# EasyEDA Pro project grandPA2.eprj, board matrix
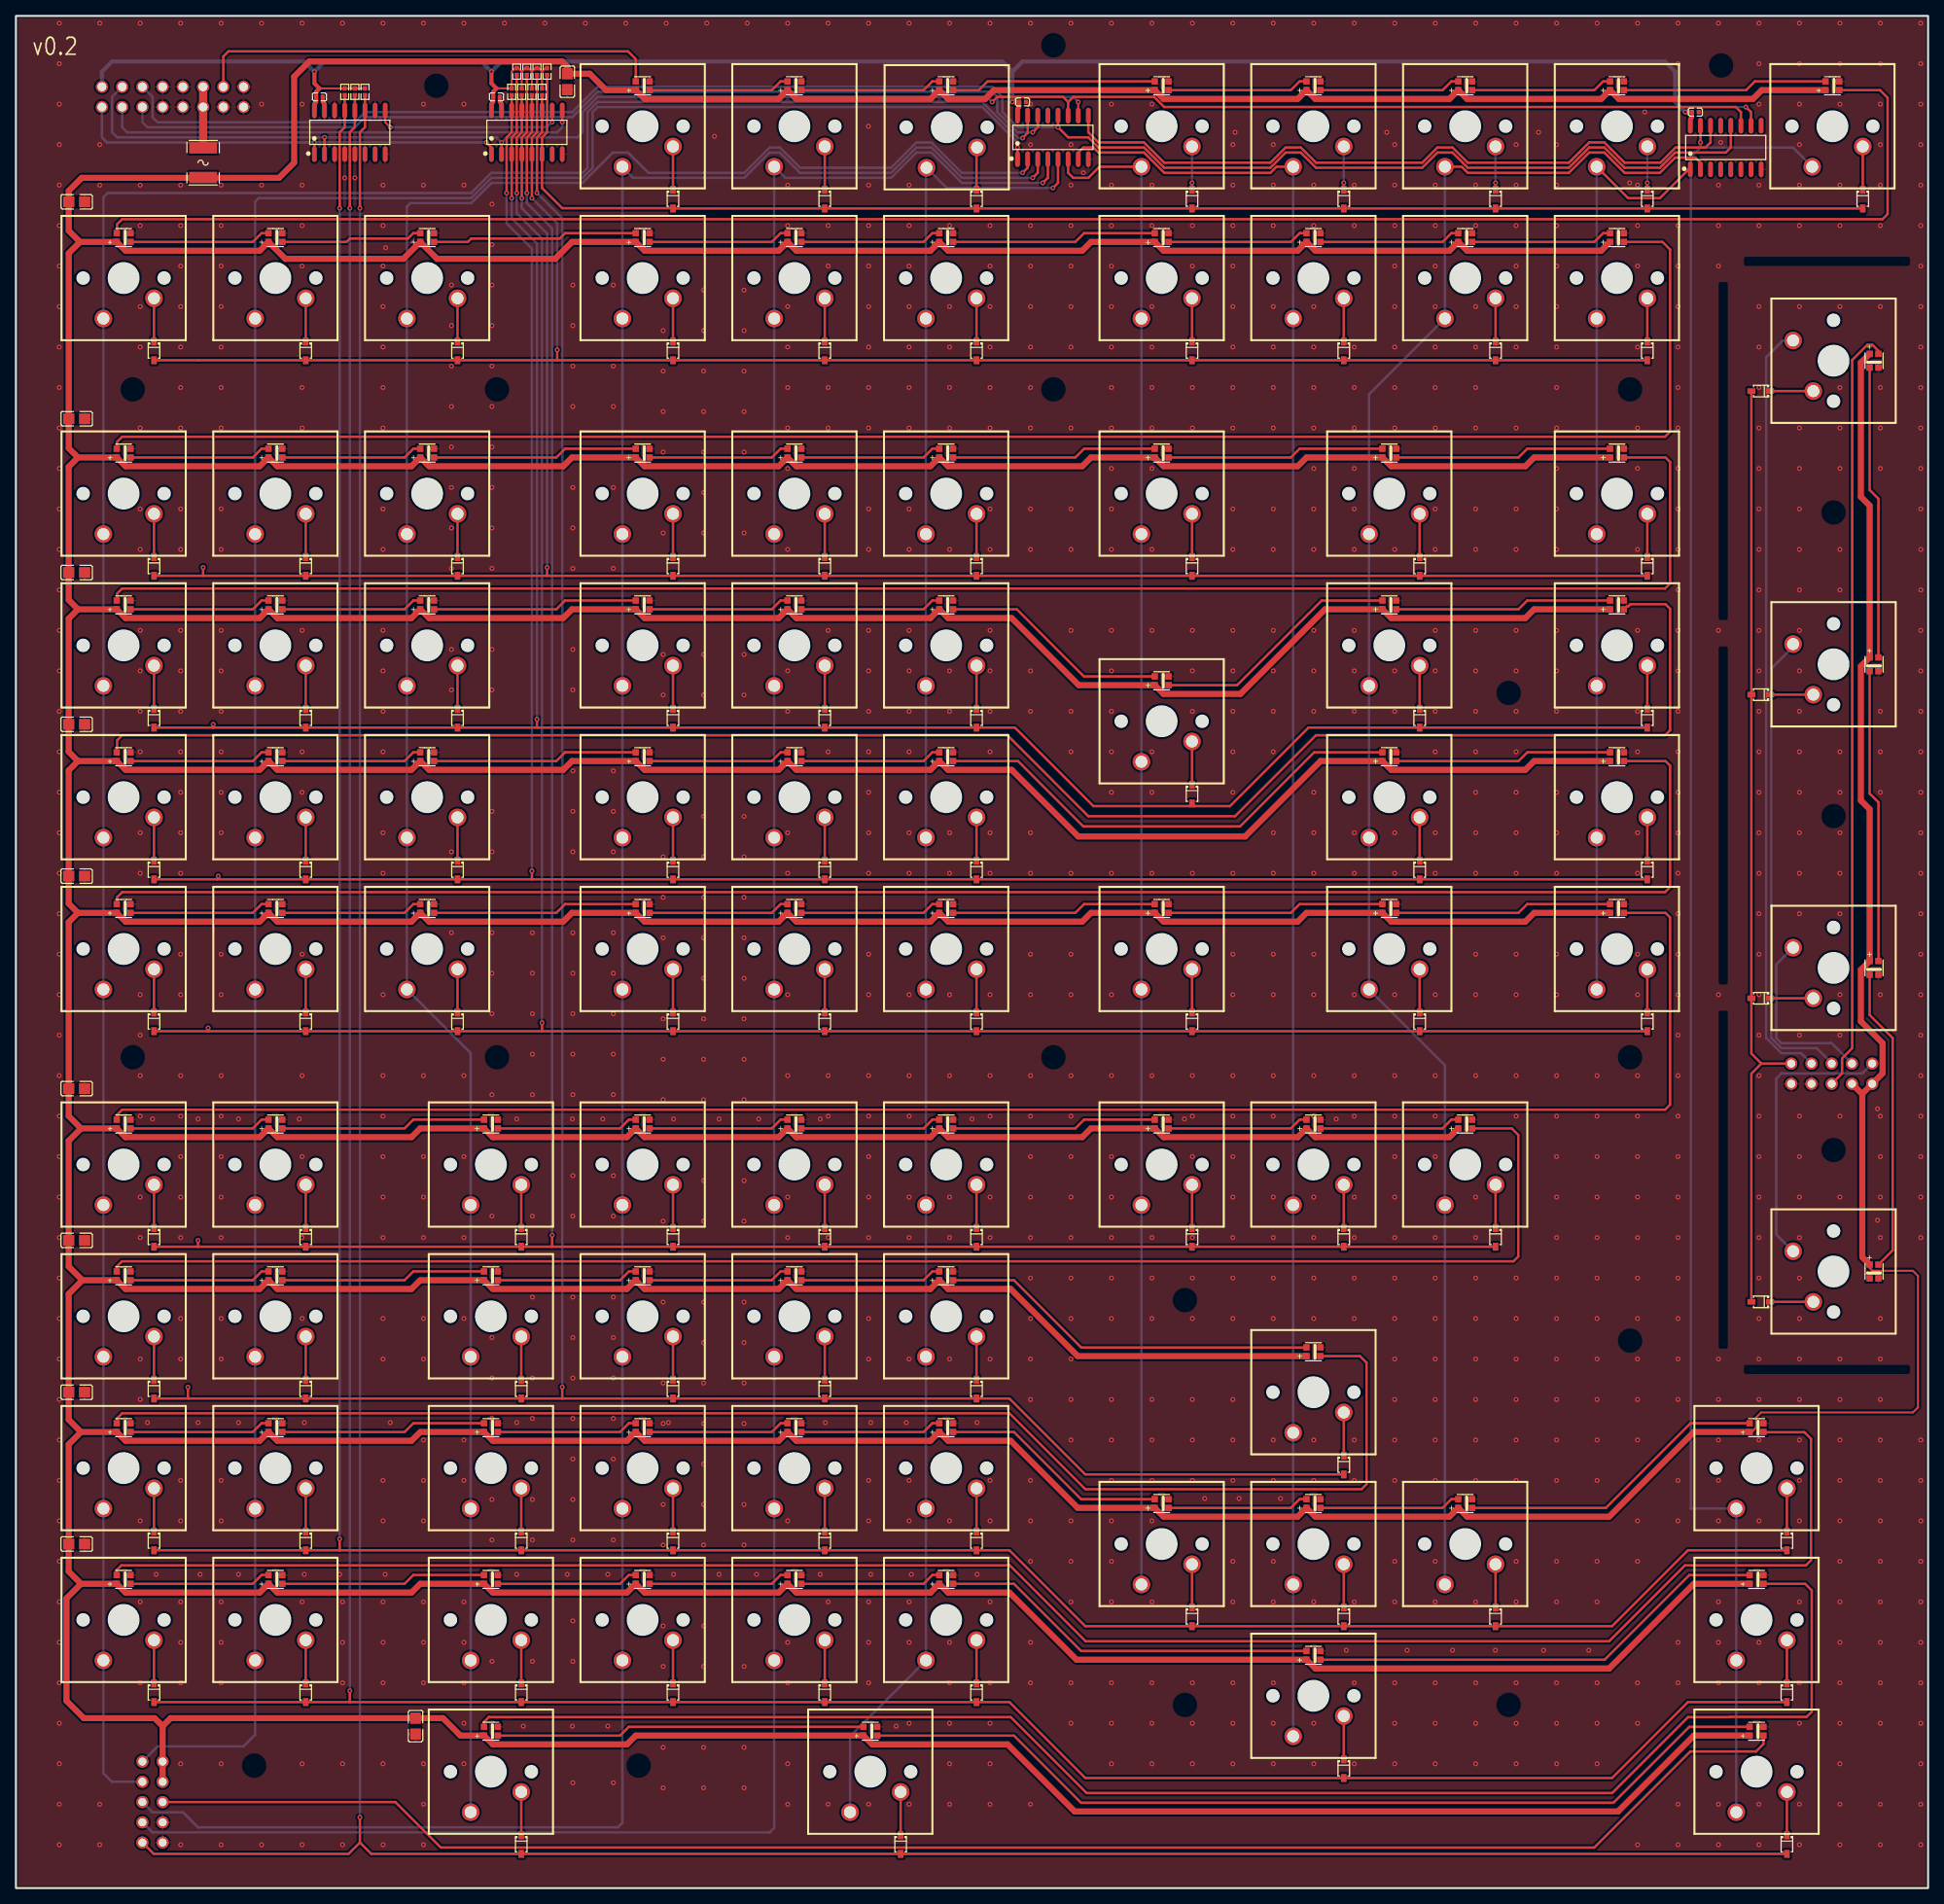
[diagram p4: board, top side]
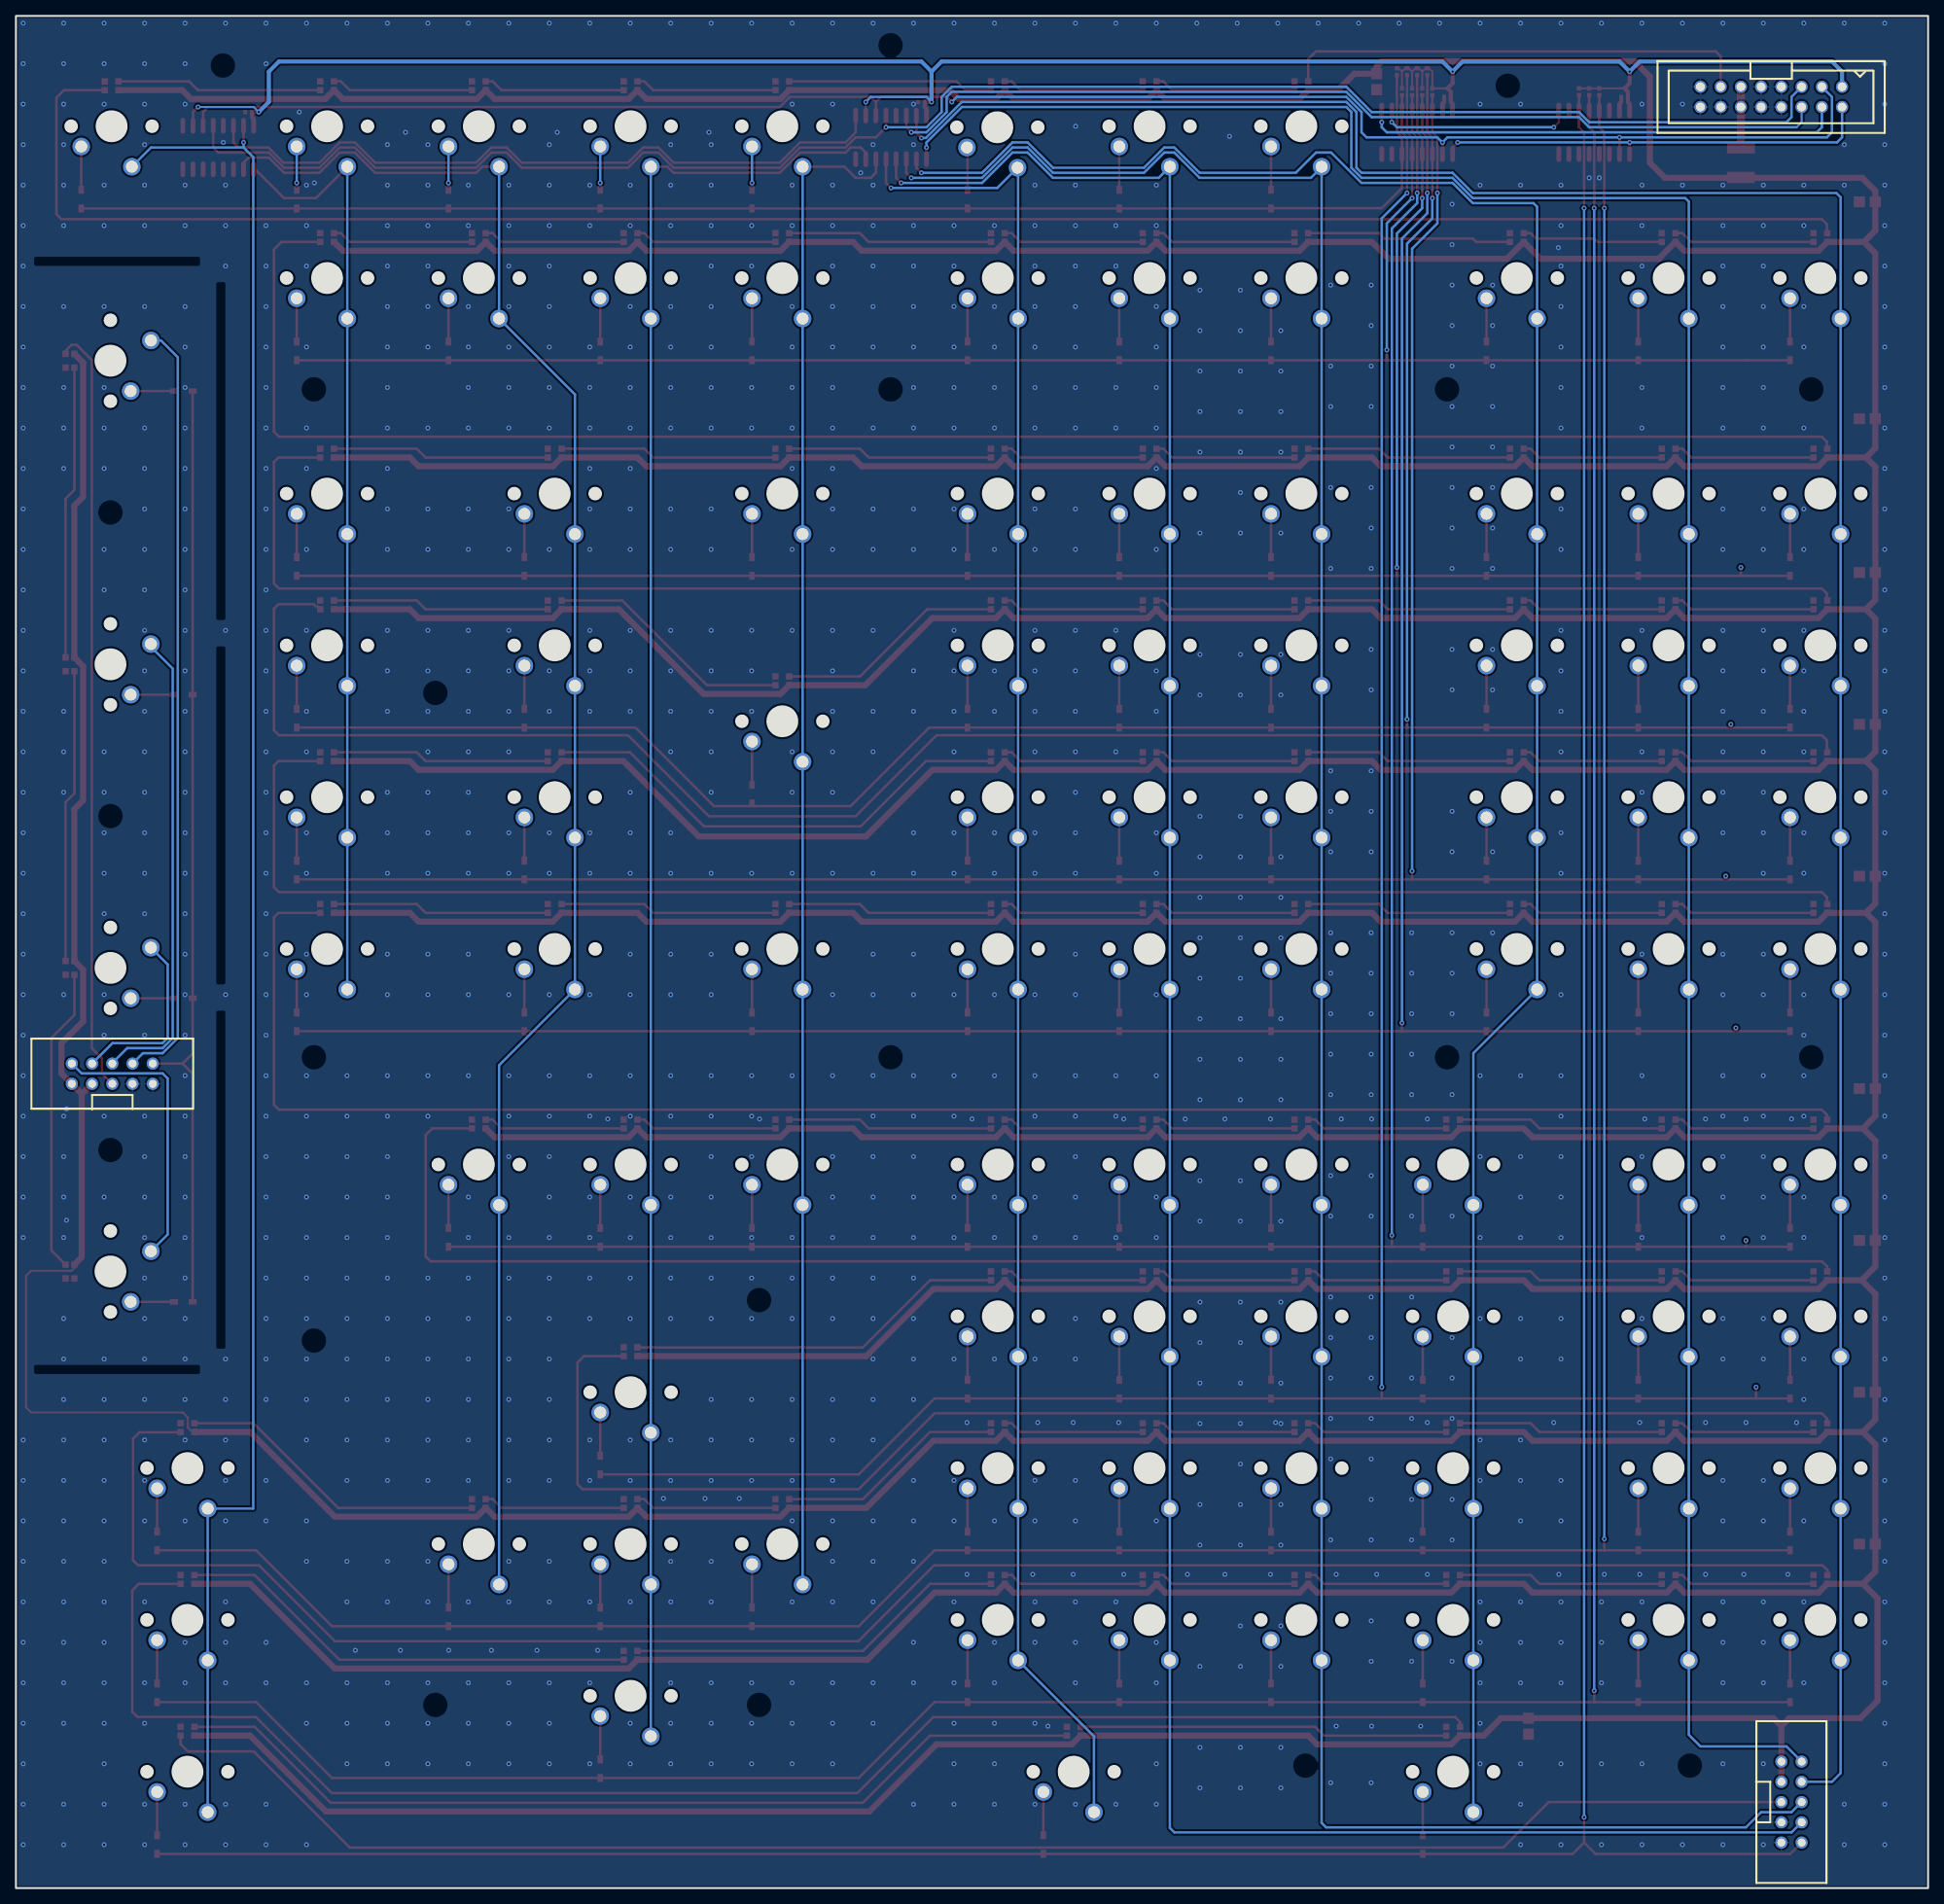
[diagram p5: board, bottom side, seen from below]

Outline 240.03 x 234.95 mm; copper layers: Top Layer, Bottom Layer. Coordinates in mm from the lower left corner of the outline.
Outline path: rectangle 0,234.95 240.03,0
Stack: Top Layer 0.035mm / Dielectric1 1.51mm FR4 er 4.5 / Bottom Layer 0.035mm

## Design rules (mm)
template: JLCPCB Capability(Two Layers Board)
spacing copperThickness1oz (default): track to track 0.102, other pairs 0.152 to 0.3
spacing copperThickness2oz: track to track 0.203, other pairs 0.152 to 0.3
track width copperThickness1oz (default): min 0.127, default 0.254, max 2.54
track width copperThickness2oz: min 0.203, default 0.254, max 2.54
differential pair differentialPair (default): width min 0.127, default 0.254, max 2.54; gap min 0.152, default 0.152
via viaSize (default): diameter min 0.5, default 0.61, max 10; hole min 0.3, default 0.305, max 6.3

## Placement (name value [footprint] x y rotation side)
C1  10uF  [C0805]  7.63 211.62 180 top
C2  10uF  [C0805]  7.63 184.4 180 top
C3  10uF  [C0805]  7.62 165.1 0 top
C4  10uF  [C0805]  7.62 100.33 180 top
C5  10uF  [C0805]  7.62 81.28 180 top
C6  10uF  [C0805]  7.62 146.05 180 top
C7  10uF  [C0805]  7.62 62.23 180 top
C8  10uF  [C0805]  7.62 43.18 180 top
C9  10uF  [C0805]  50.16 20.32 90 top
C10  10uF  [C0805]  7.62 127 180 top
C11  10uF  [C0805]  69.22 226.69 90 top
C15  100nF  [C0402]  38.1 224.79 180 top
C16  100nF  [C0402]  126.36 224.16 180 top
C17  100nF  [C0402]  60.33 224.79 180 top
C18  100nF  [C0402]  210.82 222.88 180 top
D1  1N4148WS  [SOD-323_L1.8-W1.3-LS2.5-RD]  231.83 211.96 270 top
D2  1N4148WS  [SOD-323_L1.8-W1.3-LS2.5-RD]  166.68 53.09 270 top
D3  1N4148WS  [SOD-323_L1.8-W1.3-LS2.5-RD]  166.68 14.99 270 top
D4  1N4148WS  [SOD-323_L1.8-W1.3-LS2.5-RD]  63.43 5.46 270 top
D5  1N4148WS  [SOD-323_L1.8-W1.3-LS2.5-RD]  111.06 5.46 270 top
D63  1N4148WS  [SOD-323_L1.8-W1.3-LS2.5-RD]  204.78 211.96 270 top
D64  1N4148WS  [SOD-323_L1.8-W1.3-LS2.5-RD]  204.78 192.91 270 top
D65  1N4148WS  [SOD-323_L1.8-W1.3-LS2.5-RD]  185.73 211.96 270 top
D66  1N4148WS  [SOD-323_L1.8-W1.3-LS2.5-RD]  185.73 192.91 270 top
D67  1N4148WS  [SOD-323_L1.8-W1.3-LS2.5-RD]  166.68 211.96 270 top
D68  1N4148WS  [SOD-323_L1.8-W1.3-LS2.5-RD]  166.68 192.91 270 top
D69  1N4148WS  [SOD-323_L1.8-W1.3-LS2.5-RD]  147.63 211.96 270 top
D70  1N4148WS  [SOD-323_L1.8-W1.3-LS2.5-RD]  147.63 192.91 270 top
D71  1N4148WS  [SOD-323_L1.8-W1.3-LS2.5-RD]  120.58 211.96 270 top
D72  1N4148WS  [SOD-323_L1.8-W1.3-LS2.5-RD]  120.58 192.91 270 top
D73  1N4148WS  [SOD-323_L1.8-W1.3-LS2.5-RD]  101.53 211.96 270 top
D74  1N4148WS  [SOD-323_L1.8-W1.3-LS2.5-RD]  101.53 192.91 270 top
D75  1N4148WS  [SOD-323_L1.8-W1.3-LS2.5-RD]  82.48 211.96 270 top
D76  1N4148WS  [SOD-323_L1.8-W1.3-LS2.5-RD]  82.48 192.91 270 top
D78  1N4148WS  [SOD-323_L1.8-W1.3-LS2.5-RD]  55.43 192.91 270 top
D80  1N4148WS  [SOD-323_L1.8-W1.3-LS2.5-RD]  36.38 192.91 270 top
D82  1N4148WS  [SOD-323_L1.8-W1.3-LS2.5-RD]  17.33 192.91 270 top
D83  1N4148WS  [SOD-323_L1.8-W1.3-LS2.5-RD]  120.58 165.86 270 top
D84  1N4148WS  [SOD-323_L1.8-W1.3-LS2.5-RD]  101.53 165.86 270 top
D85  1N4148WS  [SOD-323_L1.8-W1.3-LS2.5-RD]  82.48 165.86 270 top
D86  1N4148WS  [SOD-323_L1.8-W1.3-LS2.5-RD]  55.43 165.86 270 top
D87  1N4148WS  [SOD-323_L1.8-W1.3-LS2.5-RD]  36.38 165.86 270 top
D88  1N4148WS  [SOD-323_L1.8-W1.3-LS2.5-RD]  17.33 165.86 270 top
D89  1N4148WS  [SOD-323_L1.8-W1.3-LS2.5-RD]  120.58 146.81 270 top
D90  1N4148WS  [SOD-323_L1.8-W1.3-LS2.5-RD]  101.53 146.81 270 top
D91  1N4148WS  [SOD-323_L1.8-W1.3-LS2.5-RD]  82.48 146.81 270 top
D92  1N4148WS  [SOD-323_L1.8-W1.3-LS2.5-RD]  55.43 146.81 270 top
D93  1N4148WS  [SOD-323_L1.8-W1.3-LS2.5-RD]  36.38 146.81 270 top
D94  1N4148WS  [SOD-323_L1.8-W1.3-LS2.5-RD]  17.33 146.81 270 top
D95  1N4148WS  [SOD-323_L1.8-W1.3-LS2.5-RD]  120.58 127.76 270 top
D96  1N4148WS  [SOD-323_L1.8-W1.3-LS2.5-RD]  101.53 127.76 270 top
D97  1N4148WS  [SOD-323_L1.8-W1.3-LS2.5-RD]  82.48 127.76 270 top
D98  1N4148WS  [SOD-323_L1.8-W1.3-LS2.5-RD]  55.43 127.76 270 top
D99  1N4148WS  [SOD-323_L1.8-W1.3-LS2.5-RD]  36.38 127.76 270 top
D100  1N4148WS  [SOD-323_L1.8-W1.3-LS2.5-RD]  17.33 127.76 270 top
D101  1N4148WS  [SOD-323_L1.8-W1.3-LS2.5-RD]  120.58 108.71 270 top
D102  1N4148WS  [SOD-323_L1.8-W1.3-LS2.5-RD]  101.53 108.71 270 top
D103  1N4148WS  [SOD-323_L1.8-W1.3-LS2.5-RD]  82.48 108.71 270 top
D104  1N4148WS  [SOD-323_L1.8-W1.3-LS2.5-RD]  55.43 108.71 270 top
D105  1N4148WS  [SOD-323_L1.8-W1.3-LS2.5-RD]  36.38 108.71 270 top
D106  1N4148WS  [SOD-323_L1.8-W1.3-LS2.5-RD]  17.33 108.71 270 top
D107  1N4148WS  [SOD-323_L1.8-W1.3-LS2.5-RD]  120.58 81.66 270 top
D108  1N4148WS  [SOD-323_L1.8-W1.3-LS2.5-RD]  101.53 81.66 270 top
D109  1N4148WS  [SOD-323_L1.8-W1.3-LS2.5-RD]  82.48 81.66 270 top
D110  1N4148WS  [SOD-323_L1.8-W1.3-LS2.5-RD]  63.43 81.66 270 top
D111  1N4148WS  [SOD-323_L1.8-W1.3-LS2.5-RD]  36.38 81.66 270 top
D112  1N4148WS  [SOD-323_L1.8-W1.3-LS2.5-RD]  17.33 81.66 270 top
D113  1N4148WS  [SOD-323_L1.8-W1.3-LS2.5-RD]  120.58 62.61 270 top
D114  1N4148WS  [SOD-323_L1.8-W1.3-LS2.5-RD]  101.53 62.61 270 top
D115  1N4148WS  [SOD-323_L1.8-W1.3-LS2.5-RD]  82.48 62.61 270 top
D116  1N4148WS  [SOD-323_L1.8-W1.3-LS2.5-RD]  63.43 62.61 270 top
D117  1N4148WS  [SOD-323_L1.8-W1.3-LS2.5-RD]  36.38 62.61 270 top
D118  1N4148WS  [SOD-323_L1.8-W1.3-LS2.5-RD]  17.33 62.61 270 top
D119  1N4148WS  [SOD-323_L1.8-W1.3-LS2.5-RD]  120.58 43.56 270 top
D120  1N4148WS  [SOD-323_L1.8-W1.3-LS2.5-RD]  101.53 43.56 270 top
D121  1N4148WS  [SOD-323_L1.8-W1.3-LS2.5-RD]  82.48 43.56 270 top
D122  1N4148WS  [SOD-323_L1.8-W1.3-LS2.5-RD]  63.43 43.56 270 top
D123  1N4148WS  [SOD-323_L1.8-W1.3-LS2.5-RD]  36.38 43.56 270 top
D124  1N4148WS  [SOD-323_L1.8-W1.3-LS2.5-RD]  17.33 43.56 270 top
D125  1N4148WS  [SOD-323_L1.8-W1.3-LS2.5-RD]  120.58 24.51 270 top
D126  1N4148WS  [SOD-323_L1.8-W1.3-LS2.5-RD]  101.53 24.51 270 top
D127  1N4148WS  [SOD-323_L1.8-W1.3-LS2.5-RD]  82.48 24.51 270 top
D128  1N4148WS  [SOD-323_L1.8-W1.3-LS2.5-RD]  63.43 24.51 270 top
D129  1N4148WS  [SOD-323_L1.8-W1.3-LS2.5-RD]  36.38 24.51 270 top
D130  1N4148WS  [SOD-323_L1.8-W1.3-LS2.5-RD]  17.33 24.51 270 top
D131  1N4148WS  [SOD-323_L1.8-W1.3-LS2.5-RD]  204.78 165.86 270 top
D132  1N4148WS  [SOD-323_L1.8-W1.3-LS2.5-RD]  204.78 146.81 270 top
D133  1N4148WS  [SOD-323_L1.8-W1.3-LS2.5-RD]  204.78 127.76 270 top
D134  1N4148WS  [SOD-323_L1.8-W1.3-LS2.5-RD]  204.78 108.71 270 top
D135  1N4148WS  [SOD-323_L1.8-W1.3-LS2.5-RD]  176.21 165.86 270 top
D136  1N4148WS  [SOD-323_L1.8-W1.3-LS2.5-RD]  176.21 146.81 270 top
D137  1N4148WS  [SOD-323_L1.8-W1.3-LS2.5-RD]  176.21 127.76 270 top
D138  1N4148WS  [SOD-323_L1.8-W1.3-LS2.5-RD]  176.21 108.71 270 top
D139  1N4148WS  [SOD-323_L1.8-W1.3-LS2.5-RD]  147.63 165.86 270 top
D141  1N4148WS  [SOD-323_L1.8-W1.3-LS2.5-RD]  147.63 137.29 270 top
D142  1N4148WS  [SOD-323_L1.8-W1.3-LS2.5-RD]  147.63 108.71 270 top
D143  1N4148WS  [SOD-323_L1.8-W1.3-LS2.5-RD]  147.63 81.66 270 top
D144  1N4148WS  [SOD-323_L1.8-W1.3-LS2.5-RD]  166.68 81.66 270 top
D145  1N4148WS  [SOD-323_L1.8-W1.3-LS2.5-RD]  185.73 81.66 270 top
D146  1N4148WS  [SOD-323_L1.8-W1.3-LS2.5-RD]  147.63 34.04 270 top
D147  1N4148WS  [SOD-323_L1.8-W1.3-LS2.5-RD]  166.68 34.04 270 top
D148  1N4148WS  [SOD-323_L1.8-W1.3-LS2.5-RD]  185.73 34.04 270 top
D149  1N4148WS  [SOD-323_L1.8-W1.3-LS2.5-RD]  219.02 187.87 180 top
D150  1N4148WS  [SOD-323_L1.8-W1.3-LS2.5-RD]  219.02 149.77 180 top
D151  1N4148WS  [SOD-323_L1.8-W1.3-LS2.5-RD]  219.02 111.67 180 top
D152  1N4148WS  [SOD-323_L1.8-W1.3-LS2.5-RD]  219.02 73.57 180 top
D153  1N4148WS  [SOD-323_L1.8-W1.3-LS2.5-RD]  222.31 24.51 270 top
D154  1N4148WS  [SOD-323_L1.8-W1.3-LS2.5-RD]  222.31 43.56 270 top
D155  1N4148WS  [SOD-323_L1.8-W1.3-LS2.5-RD]  222.31 5.46 270 top
F1  1812L150/24MR  [F1812]  23.49 216.53 270 top
LED1  WS2812B-2020-V6  [LED-SMD_4P-L2.2-W2.0-P1.00_WS2815C-2020-4P]  228.02 226.19 180 top
LED2  WS2812B-2020-V6  [LED-SMD_4P-L2.2-W2.0-P1.00_WS2815C-2020-4P]  162.87 67.31 180 top
LED3  WS2812B-2020-V6  [LED-SMD_4P-L2.2-W2.0-P1.00_WS2815C-2020-4P]  162.87 29.21 180 top
LED4  WS2812B-2020-V6  [LED-SMD_4P-L2.2-W2.0-P1.00_WS2815C-2020-4P]  59.62 19.68 180 top
LED5  WS2812B-2020-V6  [LED-SMD_4P-L2.2-W2.0-P1.00_WS2815C-2020-4P]  107.25 19.68 180 top
LED63  WS2812B-2020-V6  [LED-SMD_4P-L2.2-W2.0-P1.00_WS2815C-2020-4P]  200.97 226.19 180 top
LED64  WS2812B-2020-V6  [LED-SMD_4P-L2.2-W2.0-P1.00_WS2815C-2020-4P]  200.97 207.14 180 top
LED65  WS2812B-2020-V6  [LED-SMD_4P-L2.2-W2.0-P1.00_WS2815C-2020-4P]  181.92 226.19 180 top
LED66  WS2812B-2020-V6  [LED-SMD_4P-L2.2-W2.0-P1.00_WS2815C-2020-4P]  181.92 207.14 180 top
LED67  WS2812B-2020-V6  [LED-SMD_4P-L2.2-W2.0-P1.00_WS2815C-2020-4P]  162.87 226.19 180 top
LED68  WS2812B-2020-V6  [LED-SMD_4P-L2.2-W2.0-P1.00_WS2815C-2020-4P]  162.87 207.14 180 top
LED69  WS2812B-2020-V6  [LED-SMD_4P-L2.2-W2.0-P1.00_WS2815C-2020-4P]  143.82 226.19 180 top
LED70  WS2812B-2020-V6  [LED-SMD_4P-L2.2-W2.0-P1.00_WS2815C-2020-4P]  143.82 207.14 180 top
LED71  WS2812B-2020-V6  [LED-SMD_4P-L2.2-W2.0-P1.00_WS2815C-2020-4P]  116.77 226.19 180 top
LED72  WS2812B-2020-V6  [LED-SMD_4P-L2.2-W2.0-P1.00_WS2815C-2020-4P]  116.77 207.14 180 top
LED73  WS2812B-2020-V6  [LED-SMD_4P-L2.2-W2.0-P1.00_WS2815C-2020-4P]  97.72 226.19 180 top
LED74  WS2812B-2020-V6  [LED-SMD_4P-L2.2-W2.0-P1.00_WS2815C-2020-4P]  97.72 207.14 180 top
LED75  WS2812B-2020-V6  [LED-SMD_4P-L2.2-W2.0-P1.00_WS2815C-2020-4P]  78.67 226.19 180 top
LED76  WS2812B-2020-V6  [LED-SMD_4P-L2.2-W2.0-P1.00_WS2815C-2020-4P]  78.67 207.14 180 top
LED78  WS2812B-2020-V6  [LED-SMD_4P-L2.2-W2.0-P1.00_WS2815C-2020-4P]  51.62 207.14 180 top
LED80  WS2812B-2020-V6  [LED-SMD_4P-L2.2-W2.0-P1.00_WS2815C-2020-4P]  32.57 207.14 180 top
LED82  WS2812B-2020-V6  [LED-SMD_4P-L2.2-W2.0-P1.00_WS2815C-2020-4P]  13.52 207.14 180 top
LED83  WS2812B-2020-V6  [LED-SMD_4P-L2.2-W2.0-P1.00_WS2815C-2020-4P]  116.77 180.09 180 top
LED84  WS2812B-2020-V6  [LED-SMD_4P-L2.2-W2.0-P1.00_WS2815C-2020-4P]  97.72 180.09 180 top
LED85  WS2812B-2020-V6  [LED-SMD_4P-L2.2-W2.0-P1.00_WS2815C-2020-4P]  78.67 180.09 180 top
LED86  WS2812B-2020-V6  [LED-SMD_4P-L2.2-W2.0-P1.00_WS2815C-2020-4P]  51.62 180.09 180 top
LED87  WS2812B-2020-V6  [LED-SMD_4P-L2.2-W2.0-P1.00_WS2815C-2020-4P]  32.57 180.09 180 top
LED88  WS2812B-2020-V6  [LED-SMD_4P-L2.2-W2.0-P1.00_WS2815C-2020-4P]  13.52 180.09 180 top
LED89  WS2812B-2020-V6  [LED-SMD_4P-L2.2-W2.0-P1.00_WS2815C-2020-4P]  116.77 161.04 180 top
LED90  WS2812B-2020-V6  [LED-SMD_4P-L2.2-W2.0-P1.00_WS2815C-2020-4P]  97.72 161.04 180 top
LED91  WS2812B-2020-V6  [LED-SMD_4P-L2.2-W2.0-P1.00_WS2815C-2020-4P]  78.67 161.04 180 top
LED92  WS2812B-2020-V6  [LED-SMD_4P-L2.2-W2.0-P1.00_WS2815C-2020-4P]  51.62 161.04 180 top
LED93  WS2812B-2020-V6  [LED-SMD_4P-L2.2-W2.0-P1.00_WS2815C-2020-4P]  32.57 161.04 180 top
LED94  WS2812B-2020-V6  [LED-SMD_4P-L2.2-W2.0-P1.00_WS2815C-2020-4P]  13.52 161.04 180 top
LED95  WS2812B-2020-V6  [LED-SMD_4P-L2.2-W2.0-P1.00_WS2815C-2020-4P]  116.77 141.99 180 top
LED96  WS2812B-2020-V6  [LED-SMD_4P-L2.2-W2.0-P1.00_WS2815C-2020-4P]  97.72 141.99 180 top
LED97  WS2812B-2020-V6  [LED-SMD_4P-L2.2-W2.0-P1.00_WS2815C-2020-4P]  78.67 141.99 180 top
LED98  WS2812B-2020-V6  [LED-SMD_4P-L2.2-W2.0-P1.00_WS2815C-2020-4P]  51.62 141.99 180 top
LED99  WS2812B-2020-V6  [LED-SMD_4P-L2.2-W2.0-P1.00_WS2815C-2020-4P]  32.57 141.99 180 top
LED100  WS2812B-2020-V6  [LED-SMD_4P-L2.2-W2.0-P1.00_WS2815C-2020-4P]  13.52 141.99 180 top
LED101  WS2812B-2020-V6  [LED-SMD_4P-L2.2-W2.0-P1.00_WS2815C-2020-4P]  116.77 122.94 180 top
LED102  WS2812B-2020-V6  [LED-SMD_4P-L2.2-W2.0-P1.00_WS2815C-2020-4P]  97.72 122.94 180 top
LED103  WS2812B-2020-V6  [LED-SMD_4P-L2.2-W2.0-P1.00_WS2815C-2020-4P]  78.67 122.94 180 top
LED104  WS2812B-2020-V6  [LED-SMD_4P-L2.2-W2.0-P1.00_WS2815C-2020-4P]  51.62 122.94 180 top
LED105  WS2812B-2020-V6  [LED-SMD_4P-L2.2-W2.0-P1.00_WS2815C-2020-4P]  32.57 122.94 180 top
LED106  WS2812B-2020-V6  [LED-SMD_4P-L2.2-W2.0-P1.00_WS2815C-2020-4P]  13.52 122.94 180 top
LED107  WS2812B-2020-V6  [LED-SMD_4P-L2.2-W2.0-P1.00_WS2815C-2020-4P]  116.77 95.88 180 top
LED108  WS2812B-2020-V6  [LED-SMD_4P-L2.2-W2.0-P1.00_WS2815C-2020-4P]  97.72 95.88 180 top
LED109  WS2812B-2020-V6  [LED-SMD_4P-L2.2-W2.0-P1.00_WS2815C-2020-4P]  78.67 95.88 180 top
LED110  WS2812B-2020-V6  [LED-SMD_4P-L2.2-W2.0-P1.00_WS2815C-2020-4P]  59.62 95.88 180 top
LED111  WS2812B-2020-V6  [LED-SMD_4P-L2.2-W2.0-P1.00_WS2815C-2020-4P]  32.57 95.88 180 top
LED112  WS2812B-2020-V6  [LED-SMD_4P-L2.2-W2.0-P1.00_WS2815C-2020-4P]  13.52 95.88 180 top
LED113  WS2812B-2020-V6  [LED-SMD_4P-L2.2-W2.0-P1.00_WS2815C-2020-4P]  116.77 76.83 180 top
LED114  WS2812B-2020-V6  [LED-SMD_4P-L2.2-W2.0-P1.00_WS2815C-2020-4P]  97.72 76.83 180 top
LED115  WS2812B-2020-V6  [LED-SMD_4P-L2.2-W2.0-P1.00_WS2815C-2020-4P]  78.67 76.83 180 top
LED116  WS2812B-2020-V6  [LED-SMD_4P-L2.2-W2.0-P1.00_WS2815C-2020-4P]  59.62 76.83 180 top
LED117  WS2812B-2020-V6  [LED-SMD_4P-L2.2-W2.0-P1.00_WS2815C-2020-4P]  32.57 76.83 180 top
LED118  WS2812B-2020-V6  [LED-SMD_4P-L2.2-W2.0-P1.00_WS2815C-2020-4P]  13.52 76.83 180 top
LED119  WS2812B-2020-V6  [LED-SMD_4P-L2.2-W2.0-P1.00_WS2815C-2020-4P]  116.77 57.78 180 top
LED120  WS2812B-2020-V6  [LED-SMD_4P-L2.2-W2.0-P1.00_WS2815C-2020-4P]  97.72 57.78 180 top
LED121  WS2812B-2020-V6  [LED-SMD_4P-L2.2-W2.0-P1.00_WS2815C-2020-4P]  78.67 57.78 180 top
LED122  WS2812B-2020-V6  [LED-SMD_4P-L2.2-W2.0-P1.00_WS2815C-2020-4P]  59.62 57.78 180 top
LED123  WS2812B-2020-V6  [LED-SMD_4P-L2.2-W2.0-P1.00_WS2815C-2020-4P]  32.57 57.78 180 top
LED124  WS2812B-2020-V6  [LED-SMD_4P-L2.2-W2.0-P1.00_WS2815C-2020-4P]  13.52 57.78 180 top
LED125  WS2812B-2020-V6  [LED-SMD_4P-L2.2-W2.0-P1.00_WS2815C-2020-4P]  116.77 38.73 180 top
LED126  WS2812B-2020-V6  [LED-SMD_4P-L2.2-W2.0-P1.00_WS2815C-2020-4P]  97.72 38.73 180 top
LED127  WS2812B-2020-V6  [LED-SMD_4P-L2.2-W2.0-P1.00_WS2815C-2020-4P]  78.67 38.73 180 top
LED128  WS2812B-2020-V6  [LED-SMD_4P-L2.2-W2.0-P1.00_WS2815C-2020-4P]  59.62 38.73 180 top
LED129  WS2812B-2020-V6  [LED-SMD_4P-L2.2-W2.0-P1.00_WS2815C-2020-4P]  32.57 38.73 180 top
LED130  WS2812B-2020-V6  [LED-SMD_4P-L2.2-W2.0-P1.00_WS2815C-2020-4P]  13.52 38.73 180 top
LED131  WS2812B-2020-V6  [LED-SMD_4P-L2.2-W2.0-P1.00_WS2815C-2020-4P]  200.97 180.09 180 top
LED132  WS2812B-2020-V6  [LED-SMD_4P-L2.2-W2.0-P1.00_WS2815C-2020-4P]  200.97 161.04 180 top
LED133  WS2812B-2020-V6  [LED-SMD_4P-L2.2-W2.0-P1.00_WS2815C-2020-4P]  200.97 141.99 180 top
LED134  WS2812B-2020-V6  [LED-SMD_4P-L2.2-W2.0-P1.00_WS2815C-2020-4P]  200.97 122.94 180 top
LED135  WS2812B-2020-V6  [LED-SMD_4P-L2.2-W2.0-P1.00_WS2815C-2020-4P]  172.4 180.09 180 top
LED136  WS2812B-2020-V6  [LED-SMD_4P-L2.2-W2.0-P1.00_WS2815C-2020-4P]  172.4 161.04 180 top
LED137  WS2812B-2020-V6  [LED-SMD_4P-L2.2-W2.0-P1.00_WS2815C-2020-4P]  172.4 141.99 180 top
LED138  WS2812B-2020-V6  [LED-SMD_4P-L2.2-W2.0-P1.00_WS2815C-2020-4P]  172.4 122.94 180 top
LED139  WS2812B-2020-V6  [LED-SMD_4P-L2.2-W2.0-P1.00_WS2815C-2020-4P]  143.82 180.09 180 top
LED141  WS2812B-2020-V6  [LED-SMD_4P-L2.2-W2.0-P1.00_WS2815C-2020-4P]  143.82 151.51 180 top
LED142  WS2812B-2020-V6  [LED-SMD_4P-L2.2-W2.0-P1.00_WS2815C-2020-4P]  143.82 122.94 180 top
LED143  WS2812B-2020-V6  [LED-SMD_4P-L2.2-W2.0-P1.00_WS2815C-2020-4P]  143.82 95.88 180 top
LED144  WS2812B-2020-V6  [LED-SMD_4P-L2.2-W2.0-P1.00_WS2815C-2020-4P]  162.87 95.88 180 top
LED145  WS2812B-2020-V6  [LED-SMD_4P-L2.2-W2.0-P1.00_WS2815C-2020-4P]  181.92 95.88 180 top
LED146  WS2812B-2020-V6  [LED-SMD_4P-L2.2-W2.0-P1.00_WS2815C-2020-4P]  143.82 48.26 180 top
LED147  WS2812B-2020-V6  [LED-SMD_4P-L2.2-W2.0-P1.00_WS2815C-2020-4P]  162.87 48.26 180 top
LED148  WS2812B-2020-V6  [LED-SMD_4P-L2.2-W2.0-P1.00_WS2815C-2020-4P]  181.92 48.26 180 top
LED149  WS2812B-2020-V6  [LED-SMD_4P-L2.2-W2.0-P1.00_WS2815C-2020-4P]  233.25 191.68 90 top
LED150  WS2812B-2020-V6  [LED-SMD_4P-L2.2-W2.0-P1.00_WS2815C-2020-4P]  233.25 153.58 90 top
LED151  WS2812B-2020-V6  [LED-SMD_4P-L2.2-W2.0-P1.00_WS2815C-2020-4P]  233.25 115.48 90 top
LED152  WS2812B-2020-V6  [LED-SMD_4P-L2.2-W2.0-P1.00_WS2815C-2020-4P]  233.25 77.38 90 top
LED153  WS2812B-2020-V6  [LED-SMD_4P-L2.2-W2.0-P1.00_WS2815C-2020-4P]  218.5 38.73 180 top
LED154  WS2812B-2020-V6  [LED-SMD_4P-L2.2-W2.0-P1.00_WS2815C-2020-4P]  218.5 57.78 180 top
LED155  WS2812B-2020-V6  [LED-SMD_4P-L2.2-W2.0-P1.00_WS2815C-2020-4P]  218.5 19.68 180 top
P1  2.54-2*8P简牛  [IDC-TH_16P-P2.54_C3406]  19.68 224.79 0 bottom
P2  2.54-2*5P简牛  [IDC-TH_10P-P2.54_C5665]  17.14 10.79 270 bottom
P3  2.54-2*5P简牛  [IDC-TH_10P-P2.54_C5665]  227.93 102.2 180 bottom
R1  10kΩ  [R0402]  66.67 227.97 90 top
R2  10kΩ  [R0402]  65.41 227.97 90 top
R3  10kΩ  [R0402]  64.14 227.97 90 top
R4  10kΩ  [R0402]  62.86 227.97 90 top
R5  10kΩ  [R0402]  62.23 225.43 90 top
R6  10kΩ  [R0402]  63.5 225.43 90 top
R7  10kΩ  [R0402]  64.77 225.43 90 top
R8  10kΩ  [R0402]  66.04 225.43 90 top
R9  10kΩ  [R0402]  41.27 225.43 90 top
R10  10kΩ  [R0402]  42.55 225.43 90 top
R11  10kΩ  [R0402]  43.81 225.43 90 top
SW1  MX1A-11NW  [SW-TH_MX1A-11NW]  228.02 221.11 180 top
SW2  MX1A-11NW  [SW-TH_MX1A-11NW]  162.87 62.23 180 top
SW3  MX1A-11NW  [SW-TH_MX1A-11NW]  162.87 24.13 180 top
SW4  MX1A-11NW  [SW-TH_MX1A-11NW]  59.62 14.6 180 top
SW5  MX1A-11NW  [SW-TH_MX1A-11NW]  107.25 14.6 180 top
SW63  MX1A-11NW  [SW-TH_MX1A-11NW]  200.97 221.11 180 top
SW64  MX1A-11NW  [SW-TH_MX1A-11NW]  200.97 202.06 180 top
SW65  MX1A-11NW  [SW-TH_MX1A-11NW]  181.92 221.11 180 top
SW66  MX1A-11NW  [SW-TH_MX1A-11NW]  181.92 202.06 180 top
SW67  MX1A-11NW  [SW-TH_MX1A-11NW]  162.87 221.11 180 top
SW68  MX1A-11NW  [SW-TH_MX1A-11NW]  162.87 202.06 180 top
SW69  MX1A-11NW  [SW-TH_MX1A-11NW]  143.82 221.11 180 top
SW70  MX1A-11NW  [SW-TH_MX1A-11NW]  143.82 202.06 180 top
SW71  MX1A-11NW  [SW-TH_MX1A-11NW]  116.84 220.98 180 top
SW72  MX1A-11NW  [SW-TH_MX1A-11NW]  116.77 202.06 180 top
SW73  MX1A-11NW  [SW-TH_MX1A-11NW]  97.72 221.11 180 top
SW74  MX1A-11NW  [SW-TH_MX1A-11NW]  97.72 202.06 180 top
SW75  MX1A-11NW  [SW-TH_MX1A-11NW]  78.67 221.11 180 top
SW76  MX1A-11NW  [SW-TH_MX1A-11NW]  78.67 202.06 180 top
SW78  MX1A-11NW  [SW-TH_MX1A-11NW]  51.62 202.06 180 top
SW80  MX1A-11NW  [SW-TH_MX1A-11NW]  32.57 202.06 180 top
SW82  MX1A-11NW  [SW-TH_MX1A-11NW]  13.52 202.06 180 top
SW83  MX1A-11NW  [SW-TH_MX1A-11NW]  116.77 175.01 180 top
SW84  MX1A-11NW  [SW-TH_MX1A-11NW]  97.72 175.01 180 top
SW85  MX1A-11NW  [SW-TH_MX1A-11NW]  78.67 175.01 180 top
SW86  MX1A-11NW  [SW-TH_MX1A-11NW]  51.62 175.01 180 top
SW87  MX1A-11NW  [SW-TH_MX1A-11NW]  32.57 175.01 180 top
SW88  MX1A-11NW  [SW-TH_MX1A-11NW]  13.52 175.01 180 top
SW89  MX1A-11NW  [SW-TH_MX1A-11NW]  116.77 155.96 180 top
SW90  MX1A-11NW  [SW-TH_MX1A-11NW]  97.72 155.96 180 top
SW91  MX1A-11NW  [SW-TH_MX1A-11NW]  78.67 155.96 180 top
SW92  MX1A-11NW  [SW-TH_MX1A-11NW]  51.62 155.96 180 top
SW93  MX1A-11NW  [SW-TH_MX1A-11NW]  32.57 155.96 180 top
SW94  MX1A-11NW  [SW-TH_MX1A-11NW]  13.52 155.96 180 top
SW95  MX1A-11NW  [SW-TH_MX1A-11NW]  116.77 136.91 180 top
SW96  MX1A-11NW  [SW-TH_MX1A-11NW]  97.72 136.91 180 top
SW97  MX1A-11NW  [SW-TH_MX1A-11NW]  78.67 136.91 180 top
SW98  MX1A-11NW  [SW-TH_MX1A-11NW]  51.62 136.91 180 top
SW99  MX1A-11NW  [SW-TH_MX1A-11NW]  32.57 136.91 180 top
SW100  MX1A-11NW  [SW-TH_MX1A-11NW]  13.52 136.91 180 top
SW101  MX1A-11NW  [SW-TH_MX1A-11NW]  116.77 117.86 180 top
SW102  MX1A-11NW  [SW-TH_MX1A-11NW]  97.72 117.86 180 top
SW103  MX1A-11NW  [SW-TH_MX1A-11NW]  78.67 117.86 180 top
SW104  MX1A-11NW  [SW-TH_MX1A-11NW]  51.62 117.86 180 top
SW105  MX1A-11NW  [SW-TH_MX1A-11NW]  32.57 117.86 180 top
SW106  MX1A-11NW  [SW-TH_MX1A-11NW]  13.52 117.86 180 top
SW107  MX1A-11NW  [SW-TH_MX1A-11NW]  116.77 90.8 180 top
SW108  MX1A-11NW  [SW-TH_MX1A-11NW]  97.72 90.8 180 top
SW109  MX1A-11NW  [SW-TH_MX1A-11NW]  78.67 90.8 180 top
SW110  MX1A-11NW  [SW-TH_MX1A-11NW]  59.62 90.8 180 top
SW111  MX1A-11NW  [SW-TH_MX1A-11NW]  32.57 90.8 180 top
SW112  MX1A-11NW  [SW-TH_MX1A-11NW]  13.52 90.8 180 top
SW113  MX1A-11NW  [SW-TH_MX1A-11NW]  116.77 71.75 180 top
SW114  MX1A-11NW  [SW-TH_MX1A-11NW]  97.72 71.75 180 top
SW115  MX1A-11NW  [SW-TH_MX1A-11NW]  78.67 71.75 180 top
SW116  MX1A-11NW  [SW-TH_MX1A-11NW]  59.62 71.75 180 top
SW117  MX1A-11NW  [SW-TH_MX1A-11NW]  32.57 71.75 180 top
SW118  MX1A-11NW  [SW-TH_MX1A-11NW]  13.52 71.75 180 top
SW119  MX1A-11NW  [SW-TH_MX1A-11NW]  116.77 52.7 180 top
SW120  MX1A-11NW  [SW-TH_MX1A-11NW]  97.72 52.7 180 top
SW121  MX1A-11NW  [SW-TH_MX1A-11NW]  78.67 52.7 180 top
SW122  MX1A-11NW  [SW-TH_MX1A-11NW]  59.62 52.7 180 top
SW123  MX1A-11NW  [SW-TH_MX1A-11NW]  32.57 52.7 180 top
SW124  MX1A-11NW  [SW-TH_MX1A-11NW]  13.52 52.7 180 top
SW125  MX1A-11NW  [SW-TH_MX1A-11NW]  116.77 33.65 180 top
SW126  MX1A-11NW  [SW-TH_MX1A-11NW]  97.72 33.65 180 top
SW127  MX1A-11NW  [SW-TH_MX1A-11NW]  78.67 33.65 180 top
SW128  MX1A-11NW  [SW-TH_MX1A-11NW]  59.62 33.65 180 top
SW129  MX1A-11NW  [SW-TH_MX1A-11NW]  32.57 33.65 180 top
SW130  MX1A-11NW  [SW-TH_MX1A-11NW]  13.52 33.65 180 top
SW131  MX1A-11NW  [SW-TH_MX1A-11NW]  200.97 175.01 180 top
SW132  MX1A-11NW  [SW-TH_MX1A-11NW]  200.97 155.96 180 top
SW133  MX1A-11NW  [SW-TH_MX1A-11NW]  200.97 136.91 180 top
SW134  MX1A-11NW  [SW-TH_MX1A-11NW]  200.97 117.86 180 top
SW135  MX1A-11NW  [SW-TH_MX1A-11NW]  172.4 175.01 180 top
SW136  MX1A-11NW  [SW-TH_MX1A-11NW]  172.4 155.96 180 top
SW137  MX1A-11NW  [SW-TH_MX1A-11NW]  172.4 136.91 180 top
SW138  MX1A-11NW  [SW-TH_MX1A-11NW]  172.4 117.86 180 top
SW139  MX1A-11NW  [SW-TH_MX1A-11NW]  143.82 175.01 180 top
SW141  MX1A-11NW  [SW-TH_MX1A-11NW]  143.82 146.43 180 top
SW142  MX1A-11NW  [SW-TH_MX1A-11NW]  143.82 117.86 180 top
SW143  MX1A-11NW  [SW-TH_MX1A-11NW]  143.82 90.8 180 top
SW144  MX1A-11NW  [SW-TH_MX1A-11NW]  162.87 90.8 180 top
SW145  MX1A-11NW  [SW-TH_MX1A-11NW]  181.92 90.8 180 top
SW146  MX1A-11NW  [SW-TH_MX1A-11NW]  143.82 43.18 180 top
SW147  MX1A-11NW  [SW-TH_MX1A-11NW]  162.87 43.18 180 top
SW148  MX1A-11NW  [SW-TH_MX1A-11NW]  181.92 43.18 180 top
SW149  MX1A-11NW  [SW-TH_MX1A-11NW]  228.17 191.68 90 top
SW150  MX1A-11NW  [SW-TH_MX1A-11NW]  228.17 153.58 90 top
SW151  MX1A-11NW  [SW-TH_MX1A-11NW]  228.17 115.48 90 top
SW152  MX1A-11NW  [SW-TH_MX1A-11NW]  228.17 77.38 90 top
SW153  MX1A-11NW  [SW-TH_MX1A-11NW]  218.5 33.65 180 top
SW154  MX1A-11NW  [SW-TH_MX1A-11NW]  218.5 52.7 180 top
SW155  MX1A-11NW  [SW-TH_MX1A-11NW]  218.5 14.6 180 top
U1  74HC595D,118  [SOIC-16_L9.9-W3.9-P1.27-LS6.0-BL]  214.63 218.44 0 top
U2  74HC595D,118  [SOIC-16_L9.9-W3.9-P1.27-LS6.0-BL]  130.18 219.71 0 top
U3  74HC165D,653  [SOIC-16_L9.9-W3.9-P1.27-LS6.0-BL]  64.14 220.34 0 top
U4  74HC165D,653  [SOIC-16_L9.9-W3.9-P1.27-LS6.0-BL]  41.91 220.34 0 top

## Footprints (pads in the part's own frame, mm; a bottom-side part is the same pattern mirrored in y, then rotated)
C0402
  rect 0.5x0.54 smd: 1(-0.42,0) 2(0.42,0)
C0805
  rect 1.41x1.35 smd: 1(-1,0) 2(1,0)
F1812
  rect 1.407x3.499 smd: 1(-1.853,0) 2(1.853,0)
IDC-TH_10P-P2.54_C5665
  round 1.524 hole 1: 1(-5.08,-1.27) 2(-5.08,1.27) 3(-2.54,-1.27) 4(-2.54,1.27) 5(0,-1.27) 6(0,1.27) 7(2.54,-1.27) 8(2.54,1.27) 9(5.08,-1.27) 10(5.08,1.27)
IDC-TH_16P-P2.54_C3406
  round 1.524 hole 1.1: 1(-8.89,-1.27) 2(-8.89,1.27) 3(-6.35,-1.27) 4(-6.35,1.27) 5(-3.81,-1.27) 6(-3.81,1.27) 7(-1.27,-1.27) 8(-1.27,1.27) 9(1.27,-1.27) 10(1.27,1.27) 11(3.81,-1.27) 12(3.81,1.27) 13(6.35,-1.27) 14(6.35,1.27) 15(8.89,-1.27) 16(8.89,1.27)
LED-SMD_4P-L2.2-W2.0-P1.00_WS2815C-2020-4P
  rect 0.8x0.8 smd: 1(-0.865,0.55) 2(-0.865,-0.55) 3(0.865,-0.55) 4(0.865,0.55)
R0402
  rect 0.566x0.54 smd: 1(-0.433,0) 2(0.433,0)
SOD-323_L1.8-W1.3-LS2.5-RD
  rect 1x0.7 smd: 1(-1.173,0) 2(1.173,0)
SOIC-16_L9.9-W3.9-P1.27-LS6.0-BL
  oval 0.602x1.971 smd: 1(-4.445,-2.736) 2(-3.175,-2.736) 3(-1.905,-2.736) 4(-0.635,-2.736) 5(0.635,-2.736) 6(1.905,-2.736) 7(3.175,-2.736) 8(4.445,-2.736) 9(4.445,2.736) 10(3.175,2.736) 11(1.905,2.736) 12(0.635,2.736) 13(-0.635,2.736) 14(-1.905,2.736) 15(-3.175,2.736) 16(-4.445,2.736)
SW-TH_MX1A-11NW
  round 2.2 hole 1.5: 1(-3.81,2.54) 2(2.54,5.08)

## Nets
3V3: C15.2 C16.2 C17.2 C18.2 P1.1 R1.2 R2.2 R3.2 R4.2 R5.2 R6.2 R7.2 R8.2 R9.2 R10.2 R11.2 U1.10 U1.16 U2.10 U2.16 U3.16 U4.16
5V: C1.2 C2.2 C3.1 C4.2 C5.2 C6.2 C7.2 C8.2 C9.2 C10.2 C11.2 F1.2 LED1.4 LED2.4 LED3.4 LED4.4 LED5.4 LED63.4 LED64.4 LED65.4 LED66.4 LED67.4 LED68.4 LED69.4 LED70.4 LED71.4 LED72.4 LED73.4 LED74.4 LED75.4 LED76.4 LED78.4 LED80.4 LED82.4 LED83.4 LED84.4 LED85.4 LED86.4 LED87.4 LED88.4 LED89.4 LED90.4 LED91.4 LED92.4 LED93.4 LED94.4 LED95.4 LED96.4 LED97.4 LED98.4 LED99.4 LED100.4 LED101.4 LED102.4 LED103.4 LED104.4 LED105.4 LED106.4 LED107.4 LED108.4 LED109.4 LED110.4 LED111.4 LED112.4 LED113.4 LED114.4 LED115.4 LED116.4 LED117.4 LED118.4 LED119.4 LED120.4 LED121.4 LED122.4 LED123.4 LED124.4 LED125.4 LED126.4 LED127.4 LED128.4 LED129.4 LED130.4 LED131.4 LED132.4 LED133.4 LED134.4 LED135.4 LED136.4 LED137.4 LED138.4 LED139.4 LED141.4 LED142.4 LED143.4 LED144.4 LED145.4 LED146.4 LED147.4 LED148.4 LED149.4 LED150.4 LED151.4 LED152.4 LED153.4 LED154.4 LED155.4 P2.1 P2.3 P3.1 P3.3
GND: C1.1 C2.1 C3.2 C4.1 C5.1 C6.1 C7.1 C8.1 C9.1 C10.1 C11.1 C15.1 C16.1 C17.1 C18.1 LED1.2 LED2.2 LED3.2 LED4.2 LED5.2 LED63.2 LED64.2 LED65.2 LED66.2 LED67.2 LED68.2 LED69.2 LED70.2 LED71.2 LED72.2 LED73.2 LED74.2 LED75.2 LED76.2 LED78.2 LED80.2 LED82.2 LED83.2 LED84.2 LED85.2 LED86.2 LED87.2 LED88.2 LED89.2 LED90.2 LED91.2 LED92.2 LED93.2 LED94.2 LED95.2 LED96.2 LED97.2 LED98.2 LED99.2 LED100.2 LED101.2 LED102.2 LED103.2 LED104.2 LED105.2 LED106.2 LED107.2 LED108.2 LED109.2 LED110.2 LED111.2 LED112.2 LED113.2 LED114.2 LED115.2 LED116.2 LED117.2 LED118.2 LED119.2 LED120.2 LED121.2 LED122.2 LED123.2 LED124.2 LED125.2 LED126.2 LED127.2 LED128.2 LED129.2 LED130.2 LED131.2 LED132.2 LED133.2 LED134.2 LED135.2 LED136.2 LED137.2 LED138.2 LED139.2 LED141.2 LED142.2 LED143.2 LED144.2 LED145.2 LED146.2 LED147.2 LED148.2 LED149.2 LED150.2 LED151.2 LED152.2 LED153.2 LED154.2 LED155.2 P1.7 P1.8 P1.9 P1.10 P1.14 P1.15 P1.16 P2.7 P2.9 P3.7 P3.9 U1.8 U1.13 U2.8 U2.13 U3.8 U3.15 U4.3 U4.4 U4.5 U4.6 U4.8 U4.10 U4.14 U4.15
$1I2620\$1N2306: D1.1 SW1.1
$1I2664\$1N2306: D63.1 SW63.1
$1I2686\$1N2306: D64.1 SW64.1
$1I2730\$1N2306: D65.1 SW65.1
$1I2752\$1N2306: D66.1 SW66.1
$1I2774\$1N2306: D67.1 SW67.1
$1I2796\$1N2306: D68.1 SW68.1
$1I2818\$1N2306: D69.1 SW69.1
$1I2840\$1N2306: D70.1 SW70.1
$1I4022\$1N2306: D71.1 SW71.1
$1I4044\$1N2306: D72.1 SW72.1
$1I4066\$1N2306: D73.1 SW73.1
$1I4088\$1N2306: D74.1 SW74.1
$1I4110\$1N2306: D75.1 SW75.1
$1I4132\$1N2306: D76.1 SW76.1
$1I4184\$1N2306: D78.1 SW78.1
$1I4228\$1N2306: D80.1 SW80.1
$1I4272\$1N2306: D82.1 SW82.1
$1I4438\$1N2306: D83.1 SW83.1
$1I4460\$1N2306: D84.1 SW84.1
$1I4482\$1N2306: D85.1 SW85.1
$1I4504\$1N2306: D86.1 SW86.1
$1I4526\$1N2306: D87.1 SW87.1
$1I4548\$1N2306: D88.1 SW88.1
$1I4578\$1N2306: D89.1 SW89.1
$1I4600\$1N2306: D90.1 SW90.1
$1I4622\$1N2306: D91.1 SW91.1
$1I4644\$1N2306: D92.1 SW92.1
$1I4666\$1N2306: D93.1 SW93.1
$1I4688\$1N2306: D94.1 SW94.1
$1I4718\$1N2306: D95.1 SW95.1
$1I4740\$1N2306: D96.1 SW96.1
$1I4762\$1N2306: D97.1 SW97.1
$1I4784\$1N2306: D98.1 SW98.1
$1I4806\$1N2306: D99.1 SW99.1
$1I4828\$1N2306: D100.1 SW100.1
$1I4858\$1N2306: D101.1 SW101.1
$1I4880\$1N2306: D102.1 SW102.1
$1I4902\$1N2306: D103.1 SW103.1
$1I4924\$1N2306: D104.1 SW104.1
$1I4946\$1N2306: D105.1 SW105.1
$1I4968\$1N2306: D106.1 SW106.1
$1I4998\$1N2306: D107.1 SW107.1
$1I5020\$1N2306: D108.1 SW108.1
$1I5042\$1N2306: D109.1 SW109.1
$1I5064\$1N2306: D110.1 SW110.1
$1I5086\$1N2306: D111.1 SW111.1
$1I5108\$1N2306: D112.1 SW112.1
$1I5424\$1N2306: D113.1 SW113.1
$1I5446\$1N2306: D114.1 SW114.1
$1I5468\$1N2306: D115.1 SW115.1
$1I5490\$1N2306: D116.1 SW116.1
$1I5512\$1N2306: D117.1 SW117.1
$1I5534\$1N2306: D118.1 SW118.1
$1I5566\$1N2306: D119.1 SW119.1
$1I5588\$1N2306: D120.1 SW120.1
$1I5610\$1N2306: D121.1 SW121.1
$1I5632\$1N2306: D122.1 SW122.1
$1I5654\$1N2306: D123.1 SW123.1
$1I5676\$1N2306: D124.1 SW124.1
$1I5708\$1N2306: D125.1 SW125.1
$1I5730\$1N2306: D126.1 SW126.1
$1I5752\$1N2306: D127.1 SW127.1
$1I5774\$1N2306: D128.1 SW128.1
$1I5796\$1N2306: D129.1 SW129.1
$1I5818\$1N2306: D130.1 SW130.1
$1I6023\$1N2306: D131.1 SW131.1
$1I6045\$1N2306: D132.1 SW132.1
$1I6067\$1N2306: D133.1 SW133.1
$1I6089\$1N2306: D134.1 SW134.1
$1I6155\$1N2306: D136.1 SW136.1
$1I6177\$1N2306: D135.1 SW135.1
$1I6199\$1N2306: D138.1 SW138.1
$1I6221\$1N2306: D137.1 SW137.1
$1I6243\$1N2306: D139.1 SW139.1
$1I6287\$1N2306: D141.1 SW141.1
$1I6309\$1N2306: D142.1 SW142.1
$1I6507\$1N2306: D143.1 SW143.1
$1I6529\$1N2306: D144.1 SW144.1
$1I6553\$1N2306: D145.1 SW145.1
$1I6621\$1N2306: D146.1 SW146.1
$1I6643\$1N2306: D147.1 SW147.1
$1I6665\$1N2306: D148.1 SW148.1
$1I6691\$1N2306: D2.1 SW2.1
$1I6735\$1N2306: D3.1 SW3.1
$1I6783\$1N2306: D4.1 SW4.1
$1I6805\$1N2306: D149.1 SW149.1
$1I6827\$1N2306: D150.1 SW150.1
$1I6849\$1N2306: D151.1 SW151.1
$1I6871\$1N2306: D152.1 SW152.1
$1I6871\DO: LED152.1
$1I6893\$1N2306: D5.1 SW5.1
$1I6915\$1N2306: D153.1 SW153.1
$1I6959\$1N2306: D154.1 SW154.1
$1I6981\$1N2306: D155.1 SW155.1
COLL: P1.5 U1.12 U2.12
COLS: P1.6 U2.14
LED: LED75.3 P1.13
ROWL: P1.2 U3.1 U4.1
ROWS: P1.4 U3.9
SCK: P1.3 U1.11 U2.11 U3.2 U4.2
$1N3652: LED67.3 LED69.1
$1N3654: LED65.3 LED67.1
$1N3656: LED63.3 LED65.1
$1N3658: LED1.3 LED63.1
$1N3660: LED64.3 LED66.1
$1N3662: LED66.3 LED68.1
$1N3664: LED68.3 LED70.1
$1N3668: D1.2 D63.2 D65.2 D67.2 D69.2 D71.2 D73.2 D75.2 R1.1 U3.6
$1N3676: D64.2 D66.2 D68.2 D70.2 D72.2 D74.2 D76.2 D78.2 D80.2 D82.2 R2.1 U3.5
$1N3683: SW69.2 SW70.2 SW139.2 SW141.2 SW142.2 SW143.2 SW146.2 U2.6
$1N3688: SW2.2 SW3.2 SW67.2 SW68.2 SW144.2 SW147.2 U2.7
$1N3698: SW63.2 SW64.2 SW131.2 SW132.2 SW133.2 SW134.2 U1.1
$1N4154: LED71.3 LED73.1
$1N4156: LED72.3 LED74.1
$1N4158: LED73.3 LED75.1
$1N4160: LED74.3 LED76.1
$1N4296: LED78.3 LED80.1
$1N4300: LED80.3 LED82.1
$1N4304: LED69.3 LED71.1
$1N4570: LED83.3 LED84.1
$1N4572: LED84.3 LED85.1
$1N4574: LED86.3 LED87.1
$1N4576: LED87.3 LED88.1
$1N4710: LED89.3 LED90.1
$1N4712: LED90.3 LED91.1
$1N4714: LED92.3 LED93.1
$1N4716: LED93.3 LED94.1
$1N4850: LED95.3 LED96.1
$1N4852: LED96.3 LED97.1
$1N4854: LED98.3 LED99.1
$1N4856: LED99.3 LED100.1
$1N4990: LED101.3 LED102.1
$1N4992: LED102.3 LED103.1
$1N4994: LED104.3 LED105.1
$1N4996: LED105.3 LED106.1
$1N5130: LED107.3 LED108.1
$1N5132: LED108.3 LED109.1
$1N5134: LED110.3 LED111.1
$1N5136: LED111.3 LED112.1
$1N5138: LED109.3 LED110.1
$1N5556: LED113.3 LED114.1
$1N5558: LED114.3 LED115.1
$1N5560: LED116.3 LED117.1
$1N5562: LED117.3 LED118.1
$1N5564: LED115.3 LED116.1
$1N5698: LED119.3 LED120.1
$1N5700: LED120.3 LED121.1
$1N5702: LED122.3 LED123.1
$1N5704: LED123.3 LED124.1
$1N5706: LED121.3 LED122.1
$1N5840: LED125.3 LED126.1
$1N5842: LED126.3 LED127.1
$1N5844: LED128.3 LED129.1
$1N5846: LED129.3 LED130.1
$1N5848: LED127.3 LED128.1
$1N6551: LED143.1 LED144.3
$1N6575: LED144.1 LED145.3
$1N6687: LED146.1 LED147.3
$1N6689: LED147.1 LED148.3
$1N7005: LED1.1 LED82.3
$1N7014: LED76.3 LED78.1
$1N7019: LED70.3 LED72.1
$1N7024: LED64.1 LED88.3
$1N7034: LED85.3 LED86.1
$1N7039: LED83.1 LED139.3
$1N7044: LED135.3 LED139.1
$1N7049: LED131.3 LED135.1
$1N7054: LED94.3 LED131.1
$1N7064: LED91.3 LED92.1
$1N7074: LED132.3 LED136.1
$1N7093: LED97.3 LED98.1
$1N7122: LED133.3 LED137.1
$1N7126: LED106.3 LED133.1
$1N7136: LED103.3 LED104.1
$1N7141: LED101.1 LED142.3
$1N7146: LED138.3 LED142.1
$1N7151: LED134.3 LED138.1
$1N7156: LED112.3 LED134.1
$1N7163: LED107.1 LED143.3
$1N7168: LED118.3 LED145.1
$1N7178: LED2.1 LED124.3
$1N7185: LED119.1 LED146.3
$1N7211: LED3.3 LED125.1
$1N7217: LED3.1 LED153.3
$1N7239: LED4.1 LED5.3
$1N7386: SW1.2 SW153.2 SW154.2 SW155.2 U1.15
$1N7677: D107.2 D108.2 D109.2 D110.2 D111.2 D112.2 D143.2 D144.2 D145.2 R7.1 U3.12
$1N7690: D2.2 D113.2 D114.2 D115.2 D116.2 D117.2 D118.2 R8.1 U3.11
$1N7722: D4.2 D5.2 D155.2 P2.10 R11.1 U4.11
$1N7845: LED100.3 LED132.1
$1N7861: D89.2 D90.2 D91.2 D92.2 D93.2 D94.2 D132.2 D136.2 D141.2 R4.1 U3.3
$1N7870: LED89.1 LED141.3
$1N7875: LED136.3 LED141.1
$1N7950: LED95.1 LED137.3
$1N8062: LED130.3 LED154.1
$1N8084: LED4.3 LED153.1
$1N8092: LED2.3 LED113.1
$1N8140: LED148.1 LED154.3
$1N8347: LED5.1 LED155.3
$1N8764: LED149.1 LED150.3
$1N8766: LED150.1 LED151.3
$1N8768: LED151.1 LED152.3
$1N8772: D149.2 D150.2 D151.2 D152.2 P3.10
$1N12570: D83.2 D84.2 D85.2 D86.2 D87.2 D88.2 D131.2 D135.2 D139.2 R3.1 U3.4
$1N12677: D101.2 D102.2 D103.2 D104.2 D105.2 D106.2 D134.2 D138.2 D142.2 R6.1 U3.13
$1N14585: D95.2 D96.2 D97.2 D98.2 D99.2 D100.2 D133.2 D137.2 R5.1 U3.14
$1N14611: D119.2 D120.2 D121.2 D122.2 D123.2 D124.2 D146.2 D147.2 D148.2 D154.2 R9.1 U4.13
$1N15532: SW65.2 SW66.2 SW135.2 SW136.2 SW137.2 SW138.2 SW145.2 SW148.2 U1.2
$1N16554: F1.1 P1.11 P1.12
$1N17072: P2.4 SW82.2 SW88.2 SW94.2 SW100.2 SW106.2 SW112.2 SW118.2 SW124.2 SW130.2 U2.15
$1N17492: U1.14 U2.9
$1N19321: LED149.3 P3.5
$1N19444: P3.8 SW149.2
$1N19455: P3.6 SW150.2
$1N19459: P3.2 SW152.2
$1N19463: P3.4 SW151.2
$1N19760: LED155.1 P2.5
$1N21463: D3.2 D125.2 D126.2 D127.2 D128.2 D129.2 D130.2 D153.2 R10.1 U4.12
$1N21690: P2.2 SW80.2 SW87.2 SW93.2 SW99.2 SW105.2 SW111.2 SW117.2 SW123.2 SW129.2 U2.1
$1N21742: P2.6 SW75.2 SW76.2 SW85.2 SW91.2 SW97.2 SW103.2 SW109.2 SW115.2 SW121.2 SW127.2 U2.3
$1N21793: P2.8 SW73.2 SW74.2 SW84.2 SW90.2 SW96.2 SW102.2 SW108.2 SW114.2 SW120.2 SW126.2 U2.4
$1N21809: SW5.2 SW71.2 SW72.2 SW83.2 SW89.2 SW95.2 SW101.2 SW107.2 SW113.2 SW119.2 SW125.2 U2.5
$1N22008: SW4.2 SW78.2 SW86.2 SW92.2 SW98.2 SW104.2 SW110.2 SW116.2 SW122.2 SW128.2 U2.2
$1N28901: U3.10 U4.9

Pads without a net: U1 3 4 5 6 7 9; U3 7; U4 7

## Via types
v1: diameter 0.61, hole 0.305, Top Layer to Bottom Layer, 1393 vias

## Routing (per net, layer and track width the routed paths; a pad name or vN(x,y) marks a point on that pad's centre or on a via; arc(x,y) is an arc through that point)
3V3: length 271.9
  Top Layer w0.254: 64.77,227.97 65.2,228.4 65.61,228.4 66.04,227.97 ; 64.77,227.97 64.77,225.86 ; 64.77,227.97 64.34,228.4 63.93,228.4 63.5,227.97 ; 66.04,227.97 66.04,225.86 ; 66.04,227.97 66.47,228.4 66.67,228.4 ; 60.33,225.86 62.23,225.86 62.23,227.97 62.66,228.4 63.07,228.4 63.5,227.97 ; 63.5,227.97 63.5,225.86 ; 38.1,225.86 43.81,225.86 ; v1(133.35,224.16) U2.10
  Top Layer w0.305: U1.10 217.81,222.88 v1(217.17,223.52)
  Top Layer w0.508: U4.16 37.47,223.94 37.68,224.16 C15.2 37.68,225.44 38.1,225.86 37.47,226.49 v1(37.47,227.97) ; U1.16 210.19,222.03 210.4,222.25 C18.2 v1(209.55,222.88) ; U3.16 59.69,223.94 59.91,224.16 C17.2 59.91,225.44 60.33,225.86 59.69,226.49 v1(59.69,227.97) ; v1(125.09,224.16) C16.2 125.95,223.52 125.73,223.31 U2.16
  Bottom Layer w0.254: v1(217.17,223.52) 210.19,223.52 v1(209.55,222.88)
  Bottom Layer w0.305: v1(133.35,224.16) 132.71,224.79 125.73,224.79 v1(125.09,224.16)
  Bottom Layer w0.508: 125.09,227.97 123.83,229.24 60.96,229.24 v1(59.69,227.97) 58.42,229.24 38.73,229.24 v1(37.47,227.97) 36.19,229.24 12.06,229.24 10.8,227.97 P1.1 ; 125.09,227.97 v1(125.09,224.16) ; 125.09,227.97 126.36,229.24 207.01,229.24 208.28,227.97 208.28,224.16 v1(209.55,222.88)
5V: length 2641.9
  Top Layer w0.254: LED152.4 232.7,77.82 233.05,77.47 238.12,77.47 238.76,76.84 238.76,60.32 238.12,59.69 219.07,59.69 218.44,59.06 218.44,57.78 217.89,57.23 LED154.4
  Top Layer w0.762: 30.6,121.28 13.76,121.28 LED106.4 7.79,122.39 ; 115.9,179.54 114.8,178.43 97.96,178.43 LED84.4 ; LED155.4 210.63,19.13 201.11,9.61 132.9,9.61 124.48,18.03 107.48,18.03 LED5.4 77.8,19.13 76.7,18.03 59.86,18.03 LED4.4 55.8,19.13 53.61,21.32 C9.2 19.41,21.32 18.41,20.32 ; 8.17,38.18 LED130.4 13.76,37.08 30.6,37.08 ; 8.17,38.18 6.35,36.36 6.35,23.5 8.52,21.32 17.41,21.32 18.41,20.32 ; 8.17,38.18 6.62,39.73 C8.2 6.62,55.68 8.17,57.23 ; LED119.4 117.01,56.13 124.86,56.13 133.29,47.71 LED146.4 144.06,46.61 160.9,46.61 162.01,47.71 ; 31.7,95.33 30.6,94.23 ; 50.75,57.23 49.65,56.13 32.81,56.13 LED123.4 ; 68.7,140.33 69.8,141.44 LED97.4 78.91,140.33 95.75,140.33 ; 218.05,224.54 219.16,225.64 LED1.4 ; LED149.4 231.6,191.44 231.6,174.6 232.7,173.5 LED150.4 231.6,153.34 231.6,136.5 232.7,135.4 LED151.4 231.6,115.24 231.6,108.77 234.31,106.05 234.31,102.23 P3.1 231.78,99.7 ; LED101.4 117.01,121.28 133.85,121.28 ; 96.85,95.33 95.75,94.23 ; 96.85,225.64 95.75,224.54 ; LED107.4 117.01,94.23 133.85,94.23 ; LED93.4 32.81,159.38 49.65,159.38 50.75,160.49 ; LED102.4 97.96,121.28 114.8,121.28 115.9,122.39 ; 179.95,224.54 163.11,224.54 LED67.4 ; 31.7,179.54 30.6,178.43 ; 96.85,141.44 95.75,140.33 ; 68.7,140.33 51.86,140.33 LED98.4 ; 115.9,225.64 114.8,224.54 97.96,224.54 LED73.4 ; 8.17,95.33 LED112.4 13.76,94.23 30.6,94.23 ; 8.17,95.33 6.62,93.78 C5.2 6.62,78 8.34,76.28 ; 8.17,95.33 6.62,96.89 C4.2 6.62,121.22 7.79,122.39 ; 18.41,20.32 P2.1 P2.3 ; 133.85,178.43 134.95,179.54 LED139.4 144.06,178.43 160.9,178.43 162.01,179.54 LED135.4 172.63,178.43 189.48,178.43 190.58,179.54 LED131.4 ; LED95.4 117.01,140.33 124.99,140.33 133.35,131.97 154.31,131.97 163.77,141.44 LED137.4 172.63,140.33 189.48,140.33 190.58,141.44 LED133.4 ; 7.79,179.54 6.63,180.7 C2.2 6.63,205.17 8.04,206.59 ; 7.79,179.54 LED88.4 13.76,178.43 30.6,178.43 ; 7.79,179.54 6.62,178.37 C3.1 6.62,161.66 7.79,160.49 ; 68.7,178.43 51.86,178.43 LED86.4 ; 7.79,141.44 6.62,140.27 C10.2 6.62,123.55 7.79,122.39 ; 7.79,141.44 LED100.4 13.76,140.33 30.6,140.33 ; 7.79,141.44 6.62,142.61 C6.2 6.62,159.32 7.79,160.49 ; 68.7,159.38 69.8,160.49 LED91.4 78.91,159.38 95.75,159.38 ; LED80.4 33.82,204.47 48.64,204.47 50.75,206.59 ; 8.04,206.59 LED82.4 13.76,205.49 30.6,205.49 ; 8.04,206.59 6.63,208 C1.2 6.63,213 8.25,214.63 33.02,214.63 34.92,216.53 34.92,227.33 36.83,229.24 68.58,229.24 69.22,228.6 C11.2 72.02,227.69 74.08,225.64 LED75.4 78.91,224.54 95.75,224.54 ; 95.75,94.23 78.91,94.23 LED109.4 ; 133.85,121.28 134.95,122.39 LED142.4 144.06,121.28 160.9,121.28 162.01,122.39 LED138.4 172.63,121.28 189.48,121.28 190.58,122.39 LED134.4 ; 30.6,56.13 13.76,56.13 LED124.4 8.17,57.23 ; 179.95,94.23 163.11,94.23 LED144.4 ; 200.11,206.59 199,205.49 182.16,205.49 LED66.4 ; 8.17,57.23 6.62,58.78 C7.2 6.62,74.56 8.34,76.28 ; 115.9,206.59 114.8,205.49 97.96,205.49 LED74.4 ; 95.75,75.18 78.91,75.18 LED115.4 ; 231.78,79.38 231.78,99.63 P3.3 ; 96.85,160.49 95.75,159.38 ; 77.8,38.18 76.7,37.08 59.86,37.08 LED128.4 50.75,38.18 49.65,37.08 32.81,37.08 LED129.4 ; LED113.4 117.01,75.18 124.86,75.18 133.29,66.76 LED2.4 ; 50.75,179.54 49.65,178.43 32.81,178.43 LED87.4 ; 77.8,57.23 76.7,56.13 59.86,56.13 LED122.4 50.8,57.23 ; 68.7,178.43 69.8,179.54 LED85.4 78.91,178.43 95.75,178.43 ; LED121.4 78.91,56.13 95.75,56.13 ; LED72.4 117.01,205.49 133.85,205.49 134.95,206.59 LED70.4 144.06,205.49 160.9,205.49 162.01,206.59 ; 68.7,121.28 51.86,121.28 LED104.4 ; 231.78,79.17 LED152.4 ; 181.06,206.59 179.95,205.49 ; 133.85,94.23 134.95,95.33 LED143.4 144.06,94.23 160.9,94.23 162.01,95.33 ; LED127.4 78.91,37.08 95.75,37.08 ; LED132.4 190.58,160.49 189.48,159.38 172.63,159.38 LED136.4 164.34,160.49 153.71,149.86 144.06,149.86 LED141.4 133.41,150.96 124.99,159.38 117.01,159.38 LED89.4 ; 95.75,121.28 78.91,121.28 LED103.4 69.8,122.39 68.7,121.28 ; 115.9,76.28 114.8,75.18 97.96,75.18 LED114.4 ; 77.8,95.33 76.7,94.23 59.86,94.23 LED110.4 50.75,95.33 49.65,94.23 32.81,94.23 LED111.4 ; LED120.4 97.96,56.13 114.8,56.13 115.9,57.23 ; 31.7,141.44 30.6,140.33 ; LED83.4 117.01,178.43 133.85,178.43 ; 31.7,122.39 30.6,121.28 ; LED99.4 32.81,140.33 49.65,140.33 50.75,141.44 ; 181.06,225.64 179.95,224.54 ; LED147.4 163.11,46.61 179.95,46.61 ; 7.79,160.49 LED94.4 13.76,159.38 30.6,159.38 ; LED105.4 32.81,121.28 49.65,121.28 50.75,122.39 ; 77.8,76.28 76.7,75.18 59.86,75.18 LED116.4 50.8,76.28 ; 96.85,179.54 95.75,178.43 ; 179.95,205.49 163.11,205.49 LED68.4 ; LED63.4 201.21,224.54 218.05,224.54 ; 95.75,205.49 78.91,205.49 LED76.4 69.8,206.59 67.69,204.47 52.87,204.47 LED78.4 ; LED148.4 182.16,46.61 200,46.61 210.63,57.23 LED154.4 ; LED125.4 117.01,37.08 124.71,37.08 133.14,28.66 LED3.4 163.11,27.56 200,27.56 210.63,38.18 LED153.4 ; 31.7,76.28 30.6,75.18 ; 8.34,76.28 LED118.4 13.76,75.18 30.6,75.18 ; 96.85,122.39 95.75,121.28 ; LED108.4 97.96,94.23 114.8,94.23 115.9,95.33 ; LED96.4 97.96,140.33 114.8,140.33 115.9,141.44 ; 181.06,47.71 179.95,46.61 ; LED92.4 51.86,159.38 68.7,159.38 ; 181.06,95.33 179.95,94.23 ; 96.85,57.23 95.75,56.13 ; 200.11,225.64 199,224.54 182.16,224.54 LED65.4 ; LED71.4 117.01,224.54 121.67,224.54 122.77,225.64 LED69.4 144.06,224.54 160.9,224.54 162.01,225.64 ; 31.7,38.18 30.6,37.08 ; LED90.4 97.96,159.38 114.8,159.38 115.9,160.49 ; 31.7,57.23 30.6,56.13 ; LED126.4 97.96,37.08 114.8,37.08 115.9,38.18 ; 96.85,206.59 95.75,205.49 ; 31.7,206.59 30.6,205.49 ; 31.7,160.49 30.6,159.38 ; 96.85,76.28 95.75,75.18 ; 96.85,38.18 95.75,37.08 ; 50.75,76.28 49.65,75.18 32.81,75.18 LED117.4
GND: length 3.6
  Top Layer w0.508: C17.1 60.75,224.16 60.96,223.94 U3.15 ; U4.15 38.73,223.94 38.52,224.16 C15.1
  vias: v1(5.44,234.04) v1(5.44,228.96) v1(5.44,223.88) v1(5.44,218.8) v1(5.44,213.72) v1(5.44,208.64) v1(5.44,203.56) v1(5.44,198.48) v1(5.44,193.4) v1(5.44,188.32) v1(5.44,183.24) v1(5.44,178.16) v1(5.44,173.08) v1(5.44,168) v1(5.44,162.92) v1(5.44,157.84) v1(5.44,152.76) v1(5.44,147.68) v1(5.44,142.6) v1(5.44,137.52) v1(5.44,132.44) v1(5.44,127.36) v1(5.44,122.28) v1(5.44,117.2) v1(5.44,112.12) v1(5.44,107.04) v1(5.44,101.96) v1(5.44,96.88) v1(5.44,91.8) v1(5.44,86.72) v1(5.44,81.64) v1(5.44,76.56) v1(5.44,71.48) v1(5.44,66.4) v1(5.44,61.32) v1(5.44,56.24) v1(5.44,51.16) v1(5.44,46.08) v1(5.44,41) v1(5.44,35.92) v1(5.44,30.84) v1(5.44,25.76) v1(5.44,20.68) v1(5.44,15.6) v1(5.44,10.52) v1(5.44,5.44) v1(10.52,234.04) v1(10.52,218.8) v1(10.52,213.72) v1(10.52,10.52) v1(10.52,5.44) v1(15.6,234.04) v1(15.6,213.72) v1(15.6,208.64) v1(15.6,198.48) v1(15.6,193.4) v1(15.6,183.24) v1(15.6,173.08) v1(15.6,168) v1(15.6,157.84) v1(15.6,152.76) v1(15.6,147.68) v1(15.6,142.6) v1(15.6,132.44) v1(15.6,127.36) v1(15.6,112.12) v1(15.6,107.04) v1(15.6,101.96) v1(15.6,96.88) v1(15.6,86.72) v1(15.6,81.64) v1(15.6,66.4) v1(15.6,61.32) v1(15.6,46.08) v1(15.6,35.92) v1(15.6,25.76) v1(16.51,58.42) v1(17.14,96.52) v1(17.6,39.37) v1(20.68,234.04) v1(20.68,213.72) v1(20.68,208.64) v1(20.68,203.56) v1(20.68,198.48) v1(20.68,193.4) v1(20.68,188.32) v1(20.68,183.24) v1(20.68,173.08) v1(20.68,168) v1(20.68,157.84) v1(20.68,152.76) v1(20.68,147.68) v1(20.68,142.6) v1(20.68,137.52) v1(20.68,132.44) v1(20.68,127.36) v1(20.68,117.2) v1(20.68,112.12) v1(20.68,101.96) v1(20.68,96.88) v1(20.68,91.8) v1(20.68,86.72) v1(20.68,81.64) v1(20.68,71.48) v1(20.68,66.4) v1(20.68,51.16) v1(20.68,46.08) v1(20.68,35.92) v1(20.68,30.84) v1(20.68,25.76) v1(20.68,15.6) v1(20.68,5.44) v1(22.86,96.52) v1(22.86,58.42) v1(23.12,39.37) v1(25.76,234.04) v1(25.76,213.72) v1(25.76,208.64) v1(25.76,203.56) v1(25.76,198.48) v1(25.76,193.4) v1(25.76,188.32) v1(25.76,183.24) v1(25.76,173.08) v1(25.76,168) v1(25.76,157.84) v1(25.76,152.76) v1(25.76,147.68) v1(25.76,142.6) v1(25.76,137.52) v1(25.76,132.44) v1(25.76,117.2) v1(25.76,112.12) v1(25.76,101.96) v1(25.76,96.88) v1(25.76,91.8) v1(25.76,86.72) v1(25.76,81.64) v1(25.76,71.48) v1(25.76,66.4) v1(25.76,51.16) v1(25.76,46.08) v1(25.76,35.92) v1(25.76,30.84) v1(25.76,25.76) v1(25.76,15.6) v1(25.76,5.44) v1(27.94,96.52) v1(27.94,58.42) v1(27.94,39.37) v1(30.84,234.04) v1(30.84,223.88) v1(30.84,213.72) v1(30.84,5.44) v1(35.56,96.52) v1(35.92,234.04) v1(35.92,223.88) v1(35.92,213.72) v1(35.92,208.64) v1(35.92,203.56) v1(35.92,188.32) v1(35.92,183.24) v1(35.92,157.84) v1(35.92,142.6) v1(35.92,137.52) v1(35.92,117.2) v1(35.92,101.96) v1(35.92,91.8) v1(35.92,81.64) v1(35.92,71.48) v1(35.92,35.92) v1(35.92,15.6) v1(35.92,5.44) v1(36.19,58.42) v1(36.19,39.37) v1(40.64,39.37) v1(41,234.04) v1(41,35.92) v1(41,30.84) v1(41,25.76) v1(41,15.6) v1(41,5.44) v1(41.27,214.63) v1(42.55,214.63) v1(46.08,234.04) v1(46.08,213.72) v1(46.08,208.64) v1(46.08,203.56) v1(46.08,198.48) v1(46.08,193.4) v1(46.08,188.32) v1(46.08,183.24) v1(46.08,173.08) v1(46.08,168) v1(46.08,157.84) v1(46.08,152.76) v1(46.08,147.68) v1(46.08,142.6) v1(46.08,132.44) v1(46.08,127.36) v1(46.08,112.12) v1(46.08,101.96) v1(46.08,96.88) v1(46.08,91.8) v1(46.08,86.72) v1(46.08,81.64) v1(46.08,71.48) v1(46.08,66.4) v1(46.08,51.16) v1(46.08,46.08) v1(46.08,35.92) v1(46.08,30.84) v1(46.08,25.76) v1(46.08,15.6) v1(46.08,5.44) v1(46.36,39.37) v1(46.41,205.87) v1(46.99,58.42) v1(51.16,234.04) v1(51.16,223.88) v1(51.16,213.72) v1(51.16,101.96) v1(51.16,91.8) v1(51.16,86.72) v1(51.16,81.64) v1(51.16,71.48) v1(51.16,66.4) v1(51.16,56.24) v1(51.16,51.16) v1(51.16,46.08) v1(51.16,35.92) v1(51.16,30.84) v1(51.16,25.76) v1(51.16,15.6) v1(51.16,10.52) v1(51.16,5.44) v1(54.67,201.17) v1(54.67,196.09) v1(54.67,191.01) v1(54.67,185.93) v1(54.67,180.85) v1(54.67,175.77) v1(54.67,170.69) v1(54.67,165.61) v1(54.67,155.45) v1(54.67,150.37) v1(54.67,130.05) v1(54.67,119.89) v1(56.24,234.04) v1(56.24,223.88) v1(56.24,213.72) v1(56.24,101.96) v1(56.24,91.8) v1(56.24,81.64) v1(56.24,71.48) v1(56.24,56.24) v1(56.24,51.16) v1(56.24,35.92) v1(56.24,30.84) v1(56.24,25.76) v1(56.24,20.68) v1(56.24,15.6) v1(59.75,211.33) v1(59.75,206.25) v1(59.75,201.17) v1(59.75,196.09) v1(59.75,191.01) v1(59.75,185.93) v1(59.75,180.85) v1(59.75,175.77) v1(59.75,170.69) v1(59.75,165.61) v1(59.75,155.45) v1(59.75,150.37) v1(59.75,135.13) v1(59.75,130.05) v1(59.75,119.89) v1(59.75,114.81) v1(59.75,109.73) v1(59.75,99.57) v1(59.75,84.33) v1(59.75,69.09) v1(59.75,64.01) v1(59.75,58.93) v1(59.75,48.77) v1(59.75,43.69) v1(59.75,28.45) v1(61.32,234.04) v1(62.86,96.52) v1(62.86,58.42) v1(62.86,39.37) v1(63.69,20.32) v1(64.83,119.89) v1(64.83,114.81) v1(64.83,109.73) v1(64.83,104.65) v1(64.83,99.57) v1(64.83,84.33) v1(64.83,74.17) v1(64.83,64.01) v1(64.83,58.93) v1(64.83,48.77) v1(64.83,43.69) v1(64.83,28.45) v1(66.4,234.04) v1(69.22,39.37) v1(69.85,96.52) v1(69.85,20.32) v1(69.91,201.17) v1(69.91,196.09) v1(69.91,191.01) v1(69.91,185.93) v1(69.91,175.77) v1(69.91,170.69) v1(69.91,165.61) v1(69.91,155.45) v1(69.91,150.37) v1(69.91,140.21) v1(69.91,135.13) v1(69.91,130.05) v1(69.91,119.89) v1(69.91,114.81) v1(69.91,109.73) v1(69.91,104.65) v1(69.91,99.57) v1(69.91,89.41) v1(69.91,84.33) v1(69.91,74.17) v1(69.91,69.09) v1(69.91,64.01) v1(69.91,58.93) v1(69.91,53.85) v1(69.91,48.77) v1(69.91,43.69) v1(69.91,33.53) v1(69.91,28.45) v1(69.91,13.21) v1(71.48,234.04) v1(73.66,96.52) v1(74.3,39.37) v1(74.3,20.32) v1(74.99,201.17) v1(74.99,191.01) v1(74.99,185.93) v1(74.99,175.77) v1(74.99,165.61) v1(74.99,140.21) v1(74.99,135.13) v1(74.99,130.05) v1(74.99,119.89) v1(74.99,114.81) v1(74.99,109.73) v1(74.99,104.65) v1(74.99,99.57) v1(74.99,89.41) v1(74.99,84.33) v1(74.99,74.17) v1(74.99,69.09) v1(74.99,64.01) v1(74.99,58.93) v1(74.99,53.85) v1(74.99,43.69) v1(74.99,13.21) v1(76.56,234.04) v1(81.24,195.46) v1(81.24,190.38) v1(81.24,185.3) v1(81.24,180.22) v1(81.24,170.06) v1(81.24,154.82) v1(81.24,149.74) v1(81.24,129.42) v1(81.24,124.34) v1(81.24,119.26) v1(81.24,109.1) v1(81.24,104.02) v1(81.24,98.94) v1(81.24,83.7) v1(81.24,73.54) v1(81.24,63.38) v1(81.24,58.3) v1(81.24,48.14) v1(81.24,43.06) v1(81.24,32.9) v1(81.24,27.82) v1(81.24,17.66) v1(81.24,12.58) v1(81.64,234.04) v1(81.91,58.42) v1(82.55,96.52) v1(82.55,39.37) v1(86.32,200.54) v1(86.32,195.46) v1(86.32,190.38) v1(86.32,185.3) v1(86.32,180.22) v1(86.32,175.14) v1(86.32,170.06) v1(86.32,154.82) v1(86.32,149.74) v1(86.32,134.5) v1(86.32,129.42) v1(86.32,124.34) v1(86.32,119.26) v1(86.32,114.18) v1(86.32,109.1) v1(86.32,104.02) v1(86.32,98.94) v1(86.32,88.78) v1(86.32,83.7) v1(86.32,73.54) v1(86.32,68.46) v1(86.32,63.38) v1(86.32,58.3) v1(86.32,53.22) v1(86.32,48.14) v1(86.32,43.06) v1(86.32,32.9) v1(86.32,27.82) v1(86.32,17.66) v1(86.32,12.58) v1(86.72,234.04) v1(87.69,219.84) v1(88.27,96.52) v1(88.27,39.37) v1(91.4,200.54) v1(91.4,195.46) v1(91.4,190.38) v1(91.4,185.3) v1(91.4,180.22) v1(91.4,170.06) v1(91.4,154.82) v1(91.4,149.74) v1(91.4,134.5) v1(91.4,129.42) v1(91.4,124.34) v1(91.4,119.26) v1(91.4,114.18) v1(91.4,109.1) v1(91.4,104.02) v1(91.4,98.94) v1(91.4,88.78) v1(91.4,83.7) v1(91.4,73.54) v1(91.4,68.46) v1(91.4,63.38) v1(91.4,58.3) v1(91.4,48.14) v1(91.4,43.06) v1(91.4,27.82) v1(91.4,17.66) v1(91.4,12.58) v1(91.8,234.04) v1(92.97,39.37) v1(93.25,96.52) v1(96.88,234.04) v1(96.88,213.72) v1(96.88,208.64) v1(96.88,198.48) v1(96.88,193.4) v1(96.88,188.32) v1(96.88,183.24) v1(96.88,178.16) v1(96.88,168) v1(96.88,152.76) v1(96.88,147.68) v1(96.88,132.44) v1(96.88,127.36) v1(96.88,112.12) v1(96.88,101.96) v1(96.88,86.72) v1(96.88,81.64) v1(96.88,46.08) v1(96.88,30.84) v1(96.88,25.76) v1(96.88,15.6) v1(96.88,10.52) v1(100.96,96.52) v1(100.96,39.37) v1(101.6,58.42) v1(101.96,234.04) v1(101.96,208.64) v1(101.96,203.56) v1(101.96,188.32) v1(101.96,183.24) v1(101.96,157.84) v1(101.96,142.6) v1(101.96,101.96) v1(101.96,96.88) v1(101.96,81.64) v1(101.96,35.92) v1(101.96,10.52) v1(107.04,234.04) v1(107.01,221.11) v1(107.04,213.72) v1(107.04,208.64) v1(107.04,203.56) v1(107.04,198.48) v1(107.04,193.4) v1(107.04,188.32) v1(107.04,183.24) v1(107.04,173.08) v1(107.04,168) v1(107.04,157.84) v1(107.04,152.76) v1(107.04,147.68) v1(107.04,142.6) v1(107.04,137.52) v1(107.04,132.44) v1(107.04,127.36) v1(107.04,117.2) v1(107.04,112.12) v1(107.04,101.96) v1(107.04,96.88) v1(107.04,91.8) v1(107.04,86.72) v1(107.04,81.64) v1(107.04,71.48) v1(107.04,66.4) v1(107.04,51.16) v1(107.04,46.08) v1(107.04,35.92) v1(107.04,30.84) v1(107.04,25.76) v1(107.04,10.52) v1(107.32,58.42) v1(107.32,39.37) v1(110.49,20.32) v1(111.76,58.42) v1(112.12,234.04) v1(112.12,213.72) v1(112.12,208.64) v1(112.12,203.56) v1(112.12,198.48) v1(112.12,193.4) v1(112.12,188.32) v1(112.12,183.24) v1(112.12,173.08) v1(112.12,168) v1(112.12,157.84) v1(112.12,152.76) v1(112.12,147.68) v1(112.12,142.6) v1(112.12,132.44) v1(112.12,127.36) v1(112.12,112.12) v1(112.12,101.96) v1(112.12,96.88) v1(112.12,86.72) v1(112.12,81.64) v1(112.12,66.4) v1(112.12,51.16) v1(112.12,46.08) v1(112.12,35.92) v1(112.12,30.84) v1(112.12,20.68) v1(112.12,10.52) v1(112.39,39.37) v1(117.2,234.04) v1(117.2,208.64) v1(117.2,198.48) v1(117.2,193.4) v1(117.2,188.32) v1(117.2,183.24) v1(117.2,168) v1(117.2,152.76) v1(117.2,147.68) v1(117.2,132.44) v1(117.2,127.36) v1(117.2,112.12) v1(117.2,101.96) v1(117.2,86.72) v1(117.2,81.64) v1(117.2,66.4) v1(117.2,46.08) v1(117.2,30.84) v1(117.2,25.76) v1(117.2,20.68) v1(117.2,15.6) v1(117.2,10.52) v1(120.02,96.52) v1(120.65,58.42) v1(120.65,39.37) v1(122.28,234.04) v1(122.28,208.64) v1(122.28,203.56) v1(122.28,198.48) v1(122.28,193.4) v1(122.28,188.32) v1(122.28,183.24) v1(122.28,173.08) v1(122.28,168) v1(122.28,157.84) v1(122.28,152.76) v1(122.28,147.68) v1(122.28,142.6) v1(122.28,132.44) v1(122.28,127.36) v1(122.28,112.12) v1(122.28,101.96) v1(122.28,96.88) v1(122.28,86.72) v1(122.28,81.64) v1(122.28,66.4) v1(122.28,51.16) v1(122.28,46.08) v1(122.28,35.92) v1(122.28,25.76) v1(122.28,20.68) v1(122.28,15.6) v1(122.28,10.52) v1(127.36,234.04) v1(127.36,223.88) v1(127.36,218.8) v1(127.36,208.64) v1(127.36,203.56) v1(127.36,198.48) v1(127.36,193.4) v1(127.36,188.32) v1(127.36,183.24) v1(127.36,173.08) v1(127.36,168) v1(127.36,152.76) v1(127.36,147.68) v1(127.36,132.44) v1(127.36,127.36) v1(127.36,117.2) v1(127.36,112.12) v1(127.36,101.96) v1(127.36,96.88) v1(127.36,91.8) v1(127.36,86.72) v1(127.36,81.64) v1(127.36,76.56) v1(127.36,71.48) v1(127.36,66.4) v1(127.36,61.32) v1(127.36,51.16) v1(127.36,46.08) v1(127.36,41) v1(127.36,30.84) v1(127.36,25.76) v1(127.36,10.52) v1(132.44,234.04) v1(132.44,218.8) v1(132.44,213.72) v1(132.44,208.64) v1(132.44,203.56) v1(132.44,198.48) v1(132.44,193.4) v1(132.44,183.24) v1(132.44,173.08) v1(132.44,168) v1(132.44,157.84) v1(132.44,147.68) v1(132.44,142.6) v1(132.44,127.36) v1(132.44,117.2) v1(132.44,112.12) v1(132.44,101.96) v1(132.44,96.88) v1(132.44,91.8) v1(132.44,86.72) v1(132.44,81.64) v1(132.44,76.56) v1(132.44,71.48) v1(132.44,66.4) v1(132.44,61.32) v1(132.44,56.24) v1(132.44,46.08) v1(132.44,41) v1(132.44,35.92) v1(132.44,25.76) v1(132.44,20.68) v1(133.99,215.26) v1(137.52,234.04) v1(137.52,223.88) v1(137.52,213.72) v1(137.52,208.64) v1(137.52,203.56) v1(137.52,198.48) v1(137.52,193.4) v1(137.52,188.32) v1(137.52,183.24) v1(137.52,178.16) v1(137.52,173.08) v1(137.52,168) v1(137.52,157.84) v1(137.52,152.76) v1(137.52,147.68) v1(137.52,142.6) v1(137.52,137.52) v1(137.52,127.36) v1(137.52,112.12) v1(137.52,101.96) v1(137.52,91.8) v1(137.52,86.72) v1(137.52,81.64) v1(137.52,76.56) v1(137.52,71.48) v1(137.52,61.32) v1(137.52,56.24) v1(137.52,51.16) v1(137.52,46.08) v1(137.52,41) v1(137.52,35.92) v1(137.52,25.76) v1(137.52,20.68) v1(137.52,15.6) v1(142.6,234.04) v1(142.6,223.88) v1(142.6,213.72) v1(142.6,208.64) v1(142.6,198.48) v1(142.6,193.4) v1(142.6,188.32) v1(142.6,183.24) v1(142.6,178.16) v1(142.6,168) v1(142.6,157.84) v1(142.6,142.6) v1(142.6,137.52) v1(142.6,127.36) v1(142.6,101.96) v1(142.6,81.64) v1(142.6,76.56) v1(142.6,71.48) v1(142.6,61.32) v1(142.6,56.24) v1(142.6,51.16) v1(142.6,46.08) v1(142.6,35.92) v1(142.6,25.76) v1(142.6,20.68) v1(142.6,15.6) v1(146.69,96.52) v1(147.68,234.04) v1(147.68,208.64) v1(147.68,203.56) v1(147.68,188.32) v1(147.68,183.24) v1(147.68,157.84) v1(147.68,152.76) v1(147.68,147.68) v1(147.68,127.36) v1(147.68,101.96) v1(147.68,96.88) v1(147.68,91.8) v1(147.68,81.64) v1(147.68,76.56) v1(147.68,71.48) v1(147.68,61.32) v1(147.68,56.24) v1(147.68,51.16) v1(147.68,25.76) v1(147.68,20.68) v1(147.68,15.6) v1(149.23,48.9) v1(152.76,234.04) v1(152.76,218.8) v1(152.76,213.72) v1(152.76,208.64) v1(152.76,203.56) v1(152.76,198.48) v1(152.76,193.4) v1(152.76,188.32) v1(152.76,183.24) v1(152.76,173.08) v1(152.76,168) v1(152.76,157.84) v1(152.76,152.76) v1(152.76,147.68) v1(152.76,142.6) v1(152.76,137.52) v1(152.76,127.36) v1(152.76,117.2) v1(152.76,112.12) v1(152.76,101.96) v1(152.76,96.88) v1(152.76,91.8) v1(152.76,86.72) v1(152.76,81.64) v1(152.76,76.56) v1(152.76,71.48) v1(152.76,61.32) v1(152.76,56.24) v1(152.76,51.16) v1(152.76,41) v1(152.76,35.92) v1(152.76,25.76) v1(152.76,20.68) v1(152.76,15.6) v1(153.04,220.34) v1(153.53,48.9) v1(157.84,234.04) v1(157.84,218.8) v1(157.84,213.72) v1(157.84,208.64) v1(157.84,198.48) v1(157.84,193.4) v1(157.84,188.32) v1(157.84,183.24) v1(157.84,173.08) v1(157.84,168) v1(157.84,157.84) v1(157.84,152.76) v1(157.84,147.68) v1(157.84,142.6) v1(157.84,132.44) v1(157.84,127.36) v1(157.84,117.2) v1(157.84,112.12) v1(157.84,101.96) v1(157.84,96.88) v1(157.84,86.72) v1(157.84,81.64) v1(157.84,76.56) v1(157.84,71.48) v1(157.84,56.24) v1(157.84,51.16) v1(157.84,41) v1(157.84,35.92) v1(157.84,25.76) v1(157.84,20.68) v1(157.84,15.6) v1(158.75,48.9) v1(162.92,234.04) v1(162.92,213.72) v1(162.92,208.64) v1(162.92,198.48) v1(162.92,193.4) v1(162.92,188.32) v1(162.92,183.24) v1(162.92,178.16) v1(162.92,173.08) v1(162.92,168) v1(162.92,157.84) v1(162.92,152.76) v1(162.92,147.68) v1(162.92,137.52) v1(162.92,132.44) v1(162.92,127.36) v1(162.92,117.2) v1(162.92,112.12) v1(162.92,101.96) v1(162.92,96.88) v1(162.92,86.72) v1(162.92,81.64) v1(162.92,76.56) v1(162.92,71.48) v1(162.92,56.24) v1(162.92,51.16) v1(162.92,35.92) v1(162.92,20.68) v1(162.92,15.6) v1(165.74,96.52) v1(167,29.84) v1(168,234.04) v1(168,213.72) v1(168,208.64) v1(168,193.4) v1(168,188.32) v1(168,183.24) v1(168,178.16) v1(168,173.08) v1(168,168) v1(168,157.84) v1(168,152.76) v1(168,147.68) v1(168,132.44) v1(168,127.36) v1(168,112.12) v1(168,101.96) v1(168,96.88) v1(168,86.72) v1(168,81.64) v1(168,76.56) v1(168,71.48) v1(168,56.24) v1(168,51.16) v1(168,35.92) v1(168,25.76) v1(168,15.6) v1(172.08,220.34) v1(173.08,234.04) v1(173.08,218.8) v1(173.08,213.72) v1(173.08,208.64) v1(173.08,203.56) v1(173.08,198.48) v1(173.08,193.4) v1(173.08,188.32) v1(173.08,183.24) v1(173.08,168) v1(173.08,152.76) v1(173.08,147.68) v1(173.08,132.44) v1(173.08,127.36) v1(173.08,112.12) v1(173.08,101.96) v1(173.08,96.88) v1(173.08,91.8) v1(173.08,86.72) v1(173.08,81.64) v1(173.08,76.56) v1(173.08,71.48) v1(173.08,66.4) v1(173.08,61.32) v1(173.08,56.24) v1(173.08,51.16) v1(173.08,41) v1(173.08,35.92) v1(173.08,25.76) v1(173.08,20.68) v1(173.08,15.6) v1(174.62,29.84) v1(178.16,234.04) v1(178.16,213.72) v1(178.16,208.64) v1(178.16,203.56) v1(178.16,198.48) v1(178.16,193.4) v1(178.16,188.32) v1(178.16,183.24) v1(178.16,173.08) v1(178.16,168) v1(178.16,157.84) v1(178.16,152.76) v1(178.16,147.68) v1(178.16,142.6) v1(178.16,132.44) v1(178.16,127.36) v1(178.16,112.12) v1(178.16,101.96) v1(178.16,96.88) v1(178.16,91.8) v1(178.16,81.64) v1(178.16,76.56) v1(178.16,71.48) v1(178.16,66.4) v1(178.16,61.32) v1(178.16,56.24) v1(178.16,51.16) v1(178.16,41) v1(178.16,35.92) v1(178.16,25.76) v1(178.16,20.68) v1(178.16,15.6) v1(180.34,29.84) v1(183.24,234.04) v1(183.24,213.72) v1(183.24,208.64) v1(183.24,198.48) v1(183.24,193.4) v1(183.24,188.32) v1(183.24,183.24) v1(183.24,173.08) v1(183.24,168) v1(183.24,157.84) v1(183.24,152.76) v1(183.24,147.68) v1(183.24,142.6) v1(183.24,137.52) v1(183.24,132.44) v1(183.24,127.36) v1(183.24,117.2) v1(183.24,112.12) v1(183.24,101.96) v1(183.24,86.72) v1(183.24,81.64) v1(183.24,76.56) v1(183.24,71.48) v1(183.24,66.4) v1(183.24,61.32) v1(183.24,56.24) v1(183.24,51.16) v1(183.24,35.92) v1(183.24,25.76) v1(183.24,20.68) v1(183.24,15.6) v1(185.71,29.84) v1(188.32,234.04) v1(188.32,218.8) v1(188.32,213.72) v1(188.32,208.64) v1(188.32,203.56) v1(188.32,198.48) v1(188.32,193.4) v1(188.32,183.24) v1(188.32,173.08) v1(188.32,168) v1(188.32,157.84) v1(188.32,152.76) v1(188.32,147.68) v1(188.32,142.6) v1(188.32,137.52) v1(188.32,132.44) v1(188.32,127.36) v1(188.32,117.2) v1(188.32,112.12) v1(188.32,101.96) v1(188.32,96.88) v1(188.32,76.56) v1(188.32,71.48) v1(188.32,66.4) v1(188.32,61.32) v1(188.32,56.24) v1(188.32,51.16) v1(188.32,41) v1(188.32,35.92) v1(188.32,25.76) v1(188.32,20.68) v1(188.32,15.6) v1(191.13,220.34) v1(191.77,29.84) v1(193.4,234.04) v1(193.4,218.8) v1(193.4,213.72) v1(193.4,208.64) v1(193.4,203.56) v1(193.4,198.48) v1(193.4,193.4) v1(193.4,188.32) v1(193.4,183.24) v1(193.4,178.16) v1(193.4,173.08) v1(193.4,168) v1(193.4,157.84) v1(193.4,152.76) v1(193.4,147.68) v1(193.4,137.52) v1(193.4,132.44) v1(193.4,127.36) v1(193.4,117.2) v1(193.4,112.12) v1(193.4,101.96) v1(193.4,96.88) v1(193.4,91.8) v1(193.4,86.72) v1(193.4,81.64) v1(193.4,76.56) v1(193.4,71.48) v1(193.4,66.4) v1(193.4,61.32) v1(193.4,56.24) v1(193.4,51.16) v1(193.4,41) v1(193.4,35.92) v1(193.4,25.76) v1(193.4,20.68) v1(193.4,15.6) v1(197.43,29.84) v1(198.48,234.04) v1(198.48,101.96) v1(198.48,96.88) v1(198.48,91.8) v1(198.48,86.72) v1(198.48,81.64) v1(198.48,76.56) v1(198.48,71.48) v1(198.48,66.4) v1(198.48,61.32) v1(198.48,56.24) v1(198.48,51.16) v1(198.48,41) v1(198.48,35.92) v1(198.48,25.76) v1(198.48,20.68) v1(198.48,15.6) v1(202.56,214) v1(203.56,234.04) v1(203.56,213.72) v1(203.56,208.64) v1(203.56,203.56) v1(203.56,193.4) v1(203.56,183.24) v1(203.56,178.16) v1(203.56,168) v1(203.56,157.84) v1(203.56,147.68) v1(203.56,142.6) v1(203.56,132.44) v1(203.56,127.36) v1(203.56,117.2) v1(203.56,112.12) v1(203.56,101.96) v1(203.56,96.88) v1(203.56,91.8) v1(203.56,86.72) v1(203.56,81.64) v1(203.56,76.56) v1(203.56,71.48) v1(203.56,66.4) v1(203.56,61.32) v1(203.56,56.24) v1(203.56,46.08) v1(203.56,41) v1(203.56,25.76) v1(203.56,20.68) v1(203.56,5.44) v1(204.47,222.88) v1(208.64,234.04) v1(208.64,228.96) v1(208.64,208.64) v1(208.64,203.56) v1(208.64,198.48) v1(208.64,193.4) v1(208.64,188.32) v1(208.64,183.24) v1(208.64,178.16) v1(208.64,173.08) v1(208.64,168) v1(208.64,162.92) v1(208.64,157.84) v1(208.64,152.76) v1(208.64,147.68) v1(208.64,142.6) v1(208.64,137.52) v1(208.64,132.44) v1(208.64,127.36) v1(208.64,122.28) v1(208.64,117.2) v1(208.64,112.12) v1(208.64,107.04) v1(208.64,101.96) v1(208.64,96.88) v1(208.64,91.8) v1(208.64,86.72) v1(208.64,81.64) v1(208.64,76.56) v1(208.64,71.48) v1(208.64,66.4) v1(208.64,61.32) v1(208.64,51.16) v1(208.64,46.08) v1(208.64,30.84) v1(208.64,25.76) v1(208.64,10.52) v1(208.64,5.44) v1(213.72,234.04) v1(213.72,213.72) v1(213.72,208.64) v1(213.72,203.56) v1(213.72,157.84) v1(213.72,112.12) v1(213.72,66.4) v1(213.72,61.32) v1(213.72,56.24) v1(213.72,51.16) v1(213.72,46.08) v1(213.72,35.92) v1(213.72,30.84) v1(213.72,25.76) v1(213.72,10.52) v1(213.72,5.44) v1(214,219.07) v1(218.8,234.04) v1(218.8,228.96) v1(218.8,223.88) v1(218.8,213.72) v1(218.8,208.64) v1(218.8,198.48) v1(218.8,193.4) v1(218.8,188.32) v1(218.8,183.24) v1(218.8,178.16) v1(218.8,173.08) v1(218.8,168) v1(218.8,162.92) v1(218.8,157.84) v1(218.8,152.76) v1(218.8,147.68) v1(218.8,142.6) v1(218.8,137.52) v1(218.8,132.44) v1(218.8,127.36) v1(218.8,122.28) v1(218.8,117.2) v1(218.8,112.12) v1(218.8,107.04) v1(218.8,101.96) v1(218.8,96.88) v1(218.8,91.8) v1(218.8,86.72) v1(218.8,81.64) v1(218.8,76.56) v1(218.8,71.48) v1(218.8,66.4) v1(218.8,61.32) v1(218.8,56.24) v1(218.8,46.08) v1(218.8,30.84) v1(218.8,25.76) v1(218.8,10.52) v1(218.8,5.44) v1(223.88,234.04) v1(223.88,228.96) v1(223.88,223.88) v1(223.88,218.8) v1(223.88,213.72) v1(223.88,208.64) v1(223.88,198.48) v1(223.88,183.24) v1(223.88,178.16) v1(223.88,173.08) v1(223.88,168) v1(223.88,162.92) v1(223.88,157.84) v1(223.88,152.76) v1(223.88,147.68) v1(223.88,142.6) v1(223.88,137.52) v1(223.88,132.44) v1(223.88,127.36) v1(223.88,122.28) v1(223.88,107.04) v1(223.88,96.88) v1(223.88,91.8) v1(223.88,86.72) v1(223.88,81.64) v1(223.88,76.56) v1(223.88,71.48) v1(223.88,66.4) v1(223.88,61.32) v1(223.88,56.24) v1(223.88,51.16) v1(223.88,46.08) v1(223.88,35.92) v1(223.88,25.76) v1(223.88,20.68) v1(223.88,10.52) v1(223.88,5.44) v1(228.96,234.04) v1(228.96,228.96) v1(228.96,223.88) v1(228.96,213.72) v1(228.96,208.64) v1(228.96,198.48) v1(228.96,188.32) v1(228.96,183.24) v1(228.96,178.16) v1(228.96,168) v1(228.96,162.92) v1(228.96,142.6) v1(228.96,137.52) v1(228.96,132.44) v1(228.96,127.36) v1(228.96,122.28) v1(228.96,112.12) v1(228.96,107.04) v1(228.96,96.88) v1(228.96,86.72) v1(228.96,66.4) v1(228.96,61.32) v1(228.96,56.24) v1(228.96,51.16) v1(228.96,46.08) v1(228.96,41) v1(228.96,35.92) v1(228.96,30.84) v1(228.96,25.76) v1(228.96,20.68) v1(228.96,15.6) v1(228.96,10.52) v1(228.96,5.44) v1(233.68,97.79) v1(233.68,83.82) v1(234.04,234.04) v1(234.04,228.96) v1(234.04,223.88) v1(234.04,218.8) v1(234.04,213.72) v1(234.04,208.64) v1(234.04,198.48) v1(234.04,188.32) v1(234.04,183.24) v1(234.04,178.16) v1(234.04,147.68) v1(234.04,142.6) v1(234.04,137.52) v1(234.04,112.12) v1(234.04,96.88) v1(234.04,91.8) v1(234.04,86.72) v1(234.04,81.64) v1(234.04,71.48) v1(234.04,66.4) v1(234.04,61.32) v1(234.04,56.24) v1(234.04,51.16) v1(234.04,46.08) v1(234.04,41) v1(234.04,35.92) v1(234.04,30.84) v1(234.04,25.76) v1(234.04,20.68) v1(234.04,10.52) v1(234.04,5.44) v1(239.12,234.04) v1(239.12,228.96) v1(239.12,223.88) v1(239.12,218.8) v1(239.12,213.72) v1(239.12,208.64) v1(239.12,203.56) v1(239.12,198.48) v1(239.12,193.4) v1(239.12,188.32) v1(239.12,183.24) v1(239.12,178.16) v1(239.12,173.08) v1(239.12,168) v1(239.12,162.92) v1(239.12,157.84) v1(239.12,152.76) v1(239.12,147.68) v1(239.12,142.6) v1(239.12,137.52) v1(239.12,132.44) v1(239.12,127.36) v1(239.12,122.28) v1(239.12,117.2) v1(239.12,112.12) v1(239.12,107.04) v1(239.12,101.96) v1(239.12,96.88) v1(239.12,91.8) v1(239.12,86.72) v1(239.12,81.64) v1(239.12,56.24) v1(239.12,51.16) v1(239.12,46.08) v1(239.12,41) v1(239.12,35.92) v1(239.12,30.84) v1(239.12,25.76) v1(239.12,20.68) v1(239.12,15.6) v1(239.12,10.52) v1(239.12,5.44)
